# Altium project LitePLC.PrjPcb
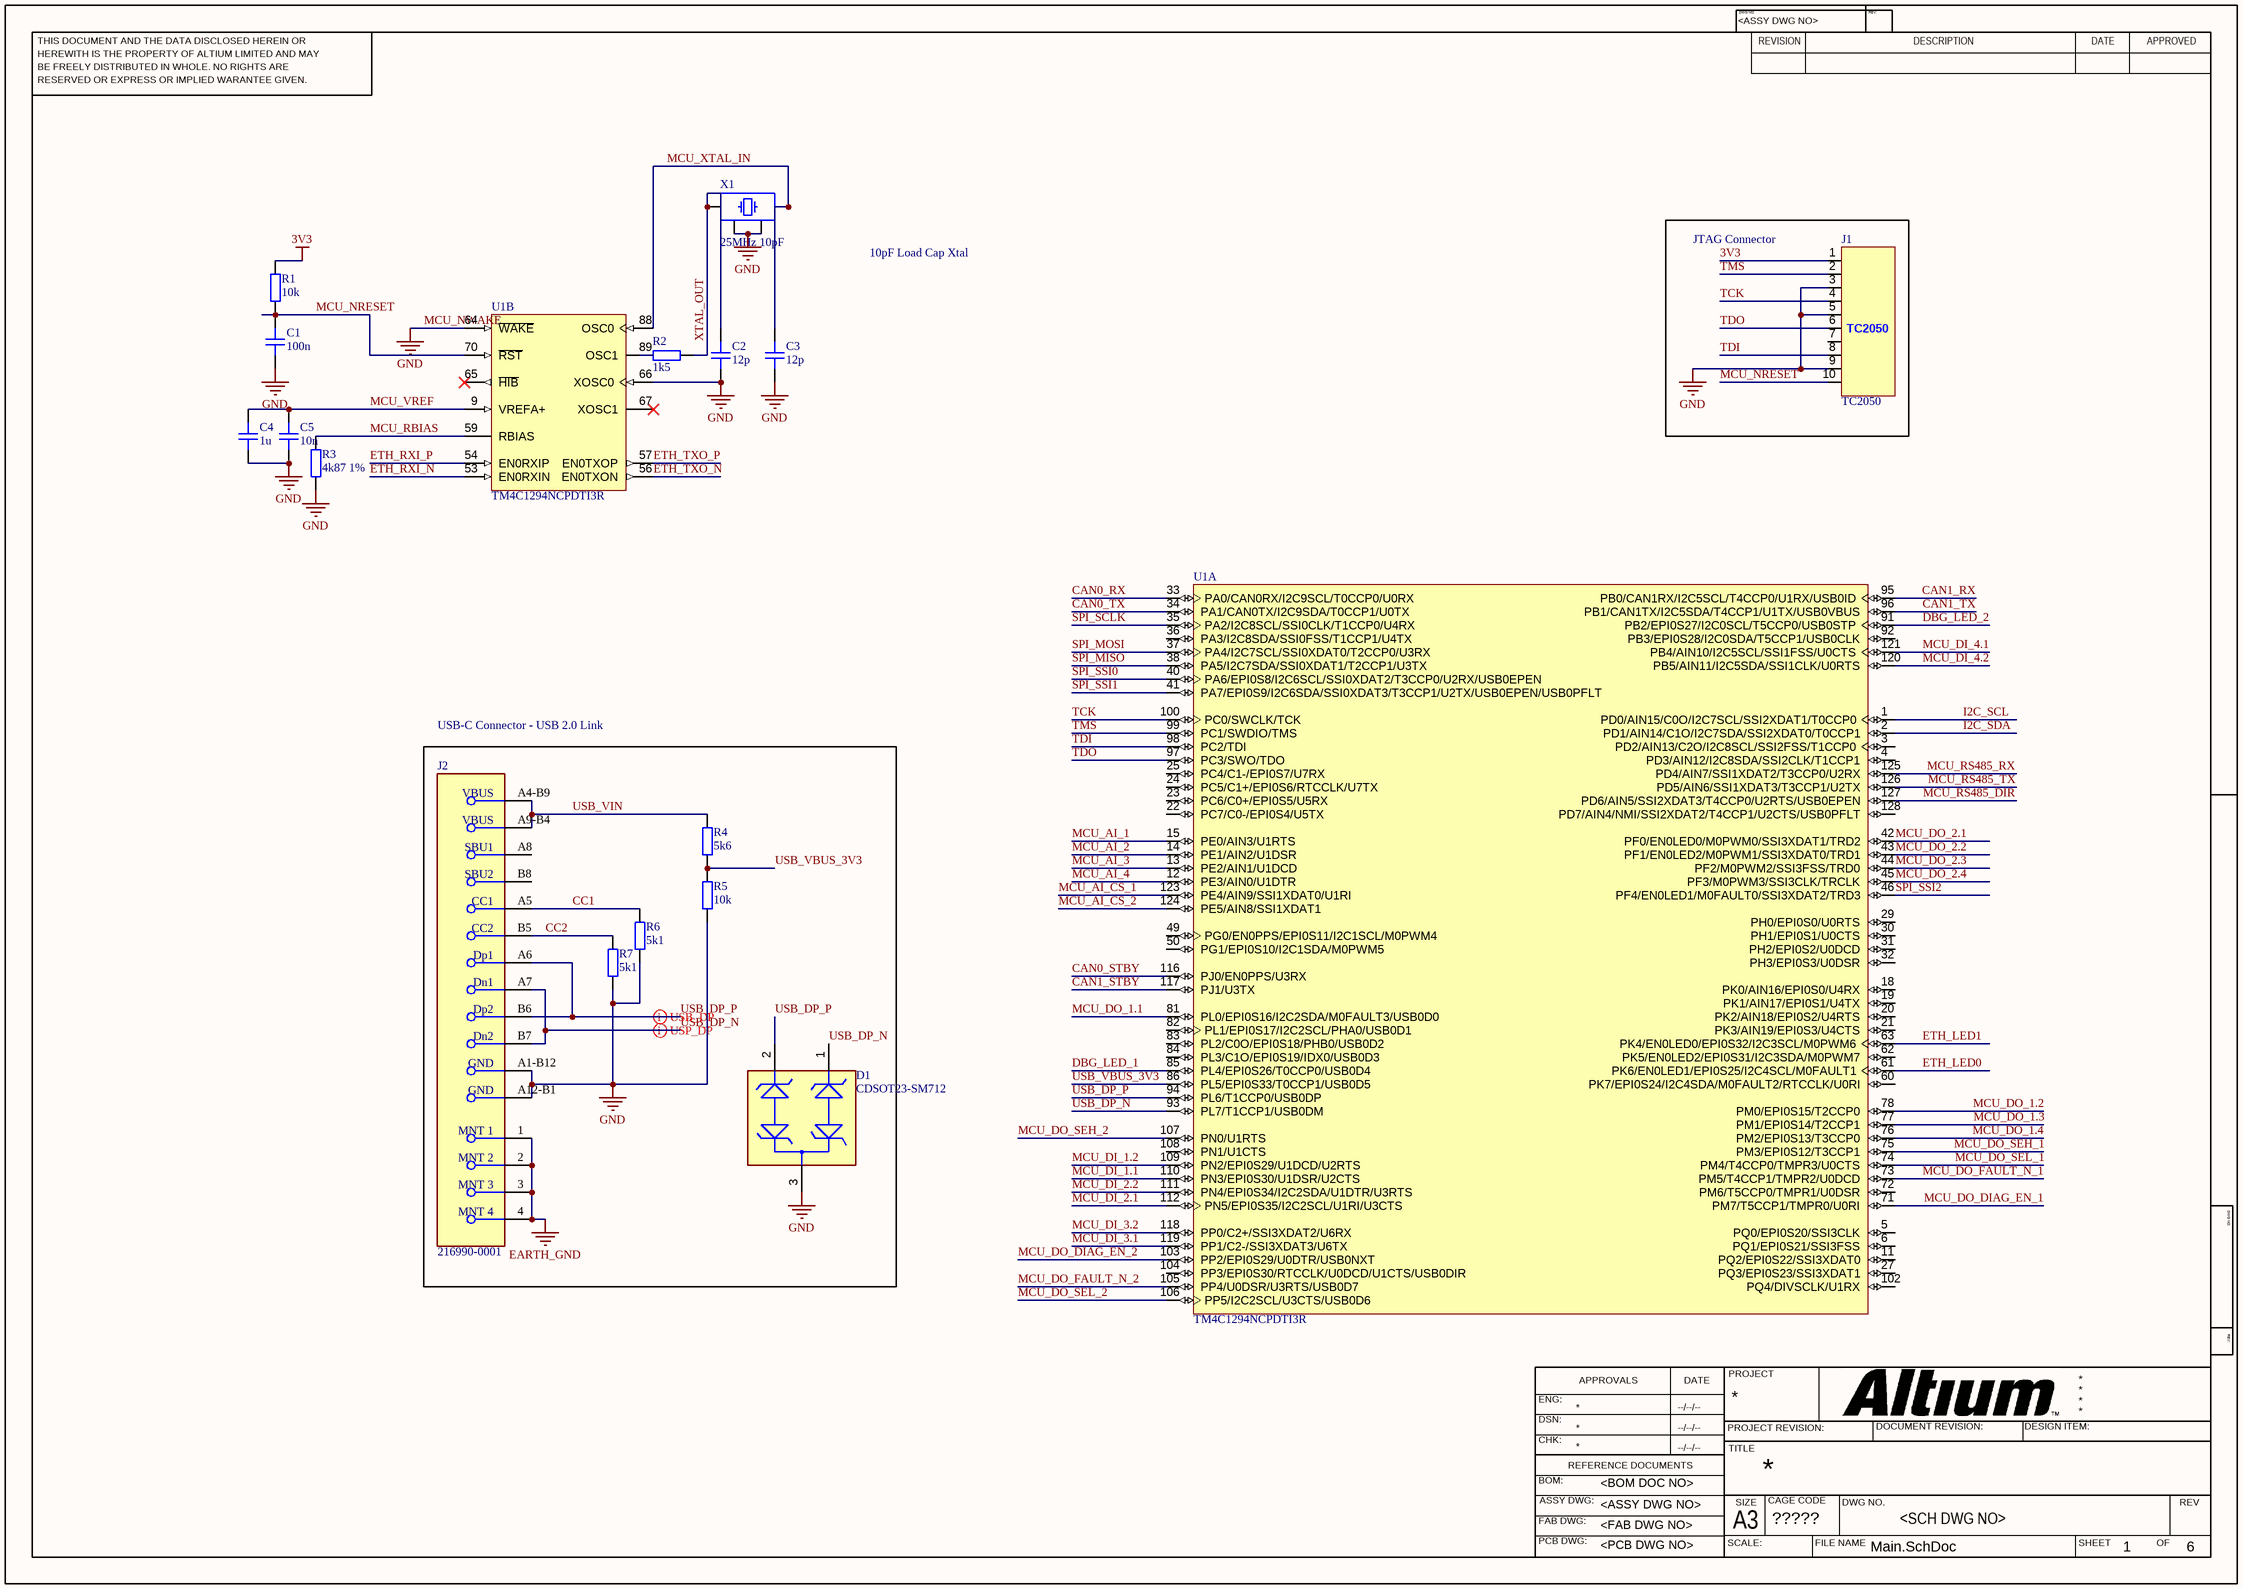
[diagram p0: Main.SchDoc]
CAGE_CODE: ?????; CONTRACT_NUMBER: <CONTRACT NO>; DOC_NO_ASSY_DWG: <ASSY DWG NO>; DOC_NO_BOM: <BOM DOC NO>; DOC_NO_FAB_DWG: <FAB DWG NO>; DOC_NO_SCH_DWG: <SCH DWG NO>; PCB_2_DEC_TOL: +/-.01; PCB_3_DEC_TOL: +/-.010; PCB_ANG_TOL: +/-1/2; PCB_ASSEMBLY_NO: <PCB ASSY NO>; PCB_CHECKER: - -----; PCB_CHECKER_APP_DATE: --/--/----; PCB_DESIGNER: - -----; PCB_DESIGNER_APP_DATE: --/--/----; PCB_DWG_NO: <PCB DWG NO>; PCB_ENGINEER: - -----; PCB_ENGINEER_APP_DATE: --/--/----; PCB_PART_NUMBER: <PCB PN>; PCB_REV: A; SCH_REV: A
5 sheets, 206 parts. Net scope: global (net labels, ports and power ports of the same name join across sheets).
Board file: PCB1.PcbDoc
Sheets:
  Main.SchDoc
  Power.SchDoc
  DigitalIO.SchDoc
  Comm.SchDoc
  Debug.SchDoc

## Sheet Main.SchDoc
size 420 x 297 mm; SheetNumber: 1; SheetTotal: 6; ENG_APP_DATE: --/--/--; DSN_APP_DATE: --/--/--; CHK_APP_DATE: --/--/--

### Parts
C1  100n  [CAP_0402]
C2  12p  [CAP_0402]
C3  12p  [CAP_0402]
C4  1u  [CAP_0402]
C5  10n  [CAP_0402]
D1  CDSOT23-SM712  [FP-SOT23-MFG]
J1  TC2050  [TC2050-FP]  (no BOM)
J2  216990-0001  [FP-216990-0001-MFG]
R1  10k  [RES_0402]
R2  1k5  [RES_0402]
R3  4k87 1%  [RES_0402]
R4  5k6  [RES_0402]
R5  10k  [RES_0402]
R6  5k1  [RES_0402]
R7  5k1  [RES_0402]
U1  TM4C1294NCPDTI3R  [PDT0128A_M]  (parts A,B of 3)
X1  25MHz 10pF  [XTAL_3225]

### Blocks framed on the sheet
JTAG Connector: J1
USB-C Connector - USB 2.0 Link: D1 J2 R4-R7

### Nets
3V3: J1.1 R1.1
EARTH_GND: J2.1(MNT_1) J2.2(MNT_2) J2.3(MNT_3) J2.4(MNT_4)
GND: C1.1 C2.1 C3.1 C4.1 C5.1 D1.3 J1.3 J1.5 J1.9 J2.A1-B12(GND) J2.A12-B1(GND) R3.1 R5.1 R6.1 R7.1 U1.64(~{WAKE}) U1.66(XOSC0) X1.2 X1.4  [also labelled MCU_NWAKE]
CAN0_RX: U1.33(PA0/CAN0RX/I2C9SCL/T0CCP0/U0RX)
CAN0_STBY: U1.116(PJ0/EN0PPS/U3RX)
CAN0_TX: U1.34(PA1/CAN0TX/I2C9SDA/T0CCP1/U0TX)
CAN1_RX: U1.95(PB0/CAN1RX/I2C5SCL/T4CCP0/U1RX/USB0ID)
CAN1_STBY: U1.117(PJ1/U3TX)
CAN1_TX: U1.96(PB1/CAN1TX/I2C5SDA/T4CCP1/U1TX/USB0VBUS)
CC1: J2.A5(CC1) R6.2
CC2: J2.B5(CC2) R7.2
DBG_LED_1: U1.85(PL4/EPI0S26/T0CCP0/USB0D4)
DBG_LED_2: U1.91(PB2/EPI0S27/I2C0SCL/T5CCP0/USB0STP)
ETH_LED0: U1.61(PK6/EN0LED1/EPI0S25/I2C4SCL/M0FAULT1)
ETH_LED1: U1.63(PK4/EN0LED0/EPI0S32/I2C3SCL/M0PWM6)
ETH_RXI_N: U1.53(EN0RXIN)
ETH_RXI_P: U1.54(EN0RXIP)
ETH_TXO_N: U1.56(EN0TXON)
ETH_TXO_P: U1.57(EN0TXOP)
I2C_SCL: U1.1(PD0/AIN15/C0O/I2C7SCL/SSI2XDAT1/T0CCP0)
I2C_SDA: U1.2(PD1/AIN14/C1O/I2C7SDA/SSI2XDAT0/T0CCP1)
MCU_AI_1: U1.15(PE0/AIN3/U1RTS)
MCU_AI_2: U1.14(PE1/AIN2/U1DSR)
MCU_AI_3: U1.13(PE2/AIN1/U1DCD)
MCU_AI_4: U1.12(PE3/AIN0/U1DTR)
MCU_AI_CS_1: U1.123(PE4/AIN9/SSI1XDAT0/U1RI)
MCU_AI_CS_2: U1.124(PE5/AIN8/SSI1XDAT1)
MCU_DI_1.1: U1.110(PN3/EPI0S30/U1DSR/U2CTS)
MCU_DI_1.2: U1.109(PN2/EPI0S29/U1DCD/U2RTS)
MCU_DI_2.1: U1.112(PN5/EPI0S35/I2C2SCL/U1RI/U3CTS)
MCU_DI_2.2: U1.111(PN4/EPI0S34/I2C2SDA/U1DTR/U3RTS)
MCU_DI_3.1: U1.119(PP1/C2-/SSI3XDAT3/U6TX)
MCU_DI_3.2: U1.118(PP0/C2+/SSI3XDAT2/U6RX)
MCU_DI_4.1: U1.121(PB4/AIN10/I2C5SCL/SSI1FSS/U0CTS)
MCU_DI_4.2: U1.120(PB5/AIN11/I2C5SDA/SSI1CLK/U0RTS)
MCU_DO_1.1: U1.81(PL0/EPI0S16/I2C2SDA/M0FAULT3/USB0D0)
MCU_DO_1.2: U1.78(PM0/EPI0S15/T2CCP0)
MCU_DO_1.3: U1.77(PM1/EPI0S14/T2CCP1)
MCU_DO_1.4: U1.76(PM2/EPI0S13/T3CCP0)
MCU_DO_2.1: U1.42(PF0/EN0LED0/M0PWM0/SSI3XDAT1/TRD2)
MCU_DO_2.2: U1.43(PF1/EN0LED2/M0PWM1/SSI3XDAT0/TRD1)
MCU_DO_2.3: U1.44(PF2/M0PWM2/SSI3FSS/TRD0)
MCU_DO_2.4: U1.45(PF3/M0PWM3/SSI3CLK/TRCLK)
MCU_DO_DIAG_EN_1: U1.71(PM7/T5CCP1/TMPR0/U0RI)
MCU_DO_DIAG_EN_2: U1.103(PP2/EPI0S29/U0DTR/USB0NXT)
MCU_DO_FAULT_N_1: U1.73(PM5/T4CCP1/TMPR2/U0DCD)
MCU_DO_FAULT_N_2: U1.105(PP4/U0DSR/U3RTS/USB0D7)
MCU_DO_SEH_1: U1.75(PM3/EPI0S12/T3CCP1)
MCU_DO_SEH_2: U1.107(PN0/U1RTS)
MCU_DO_SEL_1: U1.74(PM4/T4CCP0/TMPR3/U0CTS)
MCU_DO_SEL_2: U1.106(PP5/I2C2SCL/U3CTS/USB0D6)
MCU_NRESET: C1.2 J1.10 R1.2 U1.70(~{RST})
MCU_RBIAS: R3.2 U1.59(RBIAS)
MCU_RS485_DIR: U1.127(PD6/AIN5/SSI2XDAT3/T4CCP0/U2RTS/USB0EPEN)
MCU_RS485_RX: U1.125(PD4/AIN7/SSI1XDAT2/T3CCP0/U2RX)
MCU_RS485_TX: U1.126(PD5/AIN6/SSI1XDAT3/T3CCP1/U2TX)
MCU_VREF: C4.2 C5.2 U1.9(VREFA+)
MCU_XTAL_IN: C3.2 U1.88(OSC0) X1.3
SPI_MISO: U1.38(PA5/I2C7SDA/SSI0XDAT1/T2CCP1/U3TX)
SPI_MOSI: U1.37(PA4/I2C7SCL/SSI0XDAT0/T2CCP0/U3RX)
SPI_SCLK: U1.35(PA2/I2C8SCL/SSI0CLK/T1CCP0/U4RX)
SPI_SSI0: U1.40(PA6/EPI0S8/I2C6SCL/SSI0XDAT2/T3CCP0/U2RX/USB0EPEN)
SPI_SSI1: U1.41(PA7/EPI0S9/I2C6SDA/SSI0XDAT3/T3CCP1/U2TX/USB0EPEN/USB0PFLT)
SPI_SSI2: U1.46(PF4/EN0LED1/M0FAULT0/SSI3XDAT2/TRD3)
TCK: J1.4 U1.100(PC0/SWCLK/TCK)
TDI: J1.8 U1.98(PC2/TDI)
TDO: J1.6 U1.97(PC3/SWO/TDO)
TMS: J1.2 U1.99(PC1/SWDIO/TMS)
USB_DP_N: D1.1 J2.A7(Dn1) J2.B7(Dn2) U1.93(PL7/T1CCP1/USB0DM)
USB_DP_P: D1.2 J2.A6(Dp1) J2.B6(Dp2) U1.94(PL6/T1CCP0/USB0DP)
USB_VBUS_3V3: R4.1 R5.2 U1.86(PL5/EPI0S33/T0CCP1/USB0D5)
USB_VIN: J2.A4-B9(VBUS) J2.A9-B4(VBUS) R4.2
XTAL_OUT: C2.2 R2.2 X1.1
NetR2_1: R2.1 U1.89(OSC1)

Not connected (* = marked no-connect by the designer): J1 7; J2 A8(SBU1) B8(SBU2); U1 3(PD2/AIN13/C2O/I2C8SCL/SSI2FSS/T1CCP0) 4(PD3/AIN12/I2C8SDA/SSI2CLK/T1CCP1) 5(PQ0/EPI0S20/SSI3CLK) 6(PQ1/EPI0S21/SSI3FSS) 11(PQ2/EPI0S22/SSI3XDAT0) 18(PK0/AIN16/EPI0S0/U4RX) 19(PK1/AIN17/EPI0S1/U4TX) 20(PK2/AIN18/EPI0S2/U4RTS) 21(PK3/AIN19/EPI0S3/U4CTS) 22(PC7/C0-/EPI0S4/U5TX) 23(PC6/C0+/EPI0S5/U5RX) 24(PC5/C1+/EPI0S6/RTCCLK/U7TX) 25(PC4/C1-/EPI0S7/U7RX) 27(PQ3/EPI0S23/SSI3XDAT1) 29(PH0/EPI0S0/U0RTS) 30(PH1/EPI0S1/U0CTS) 31(PH2/EPI0S2/U0DCD) 32(PH3/EPI0S3/U0DSR) 36(PA3/I2C8SDA/SSI0FSS/T1CCP1/U4TX) 49(PG0/EN0PPS/EPI0S11/I2C1SCL/M0PWM4) 50(PG1/EPI0S10/I2C1SDA/M0PWM5) 60(PK7/EPI0S24/I2C4SDA/M0FAULT2/RTCCLK/U0RI) 62(PK5/EN0LED2/EPI0S31/I2C3SDA/M0PWM7) 65(~{HIB})* 67(XOSC1)* 72(PM6/T5CCP0/TMPR1/U0DSR) 82(PL1/EPI0S17/I2C2SCL/PHA0/USB0D1) 83(PL2/C0O/EPI0S18/PHB0/USB0D2) 84(PL3/C1O/EPI0S19/IDX0/USB0D3) 92(PB3/EPI0S28/I2C0SDA/T5CCP1/USB0CLK) 102(PQ4/DIVSCLK/U1RX) 104(PP3/EPI0S30/RTCCLK/U0DCD/U1CTS/USB0DIR) 108(PN1/U1CTS) 128(PD7/AIN4/NMI/SSI2XDAT2/T4CCP1/U2CTS/USB0PFLT)

### Layout directives
differential pair; differential pair class USB: USB_DP_N, USB_DP_P

### Notes on the sheet
- 10pF Load Cap Xtal
- THIS DOCUMENT AND THE DATA DISCLOSED HEREIN OR
- HEREWITH IS THE PROPERTY OF ALTIUM LIMITED AND MAY
- DWG NO:
- REVISION
- REV:
- DESCRIPTION
- DATE
- APPROVED
- BE FREELY DISTRIBUTED IN WHOLE. NO RIGHTS ARE
- RESERVED OR EXPRESS OR IMPLIED WARANTEE GIVEN.
- ENG:
- APPROVALS
- PROJECT
- DSN:
- CHK:
- REFERENCE DOCUMENTS
- PROJECT REVISION:
- TITLE
- DOCUMENT REVISION:
- DESIGN ITEM:
- BOM:
- FAB DWG:
- PCB DWG:
- ASSY DWG:
- SCALE:
- A3
- SIZE
- CAGE CODE
- FILE NAME
- DWG NO.
- SHEET
- OF
- REV

### Library data of the parts
C1-C5 = CAP_0402: Capacitor SMD 0402; Manufacturer: *; Manufacturer Part Number: *; Distributor Link: *; LCSC: *; Rating: *; Dielectric: *
D1 = CMP-2000-05081-2: TVS DIODE 5V; Manufacturer: Bourns Inc.; Peak Pulse Current: 17A; Standoff Height: 0.05mm; Breakdown Voltage: 7.5V; Direction: Bidirectional; Clamping Voltage: 26V; Value: 75pF; Number Of Channels: 2; Reverse Standoff Voltage: 12V; Peak Pulse Power: 400W; Temperature Range Low: -55°C; Mouser Description: Transient Voltage Suppressor, TVS, CDSOT23 Series, Unidirectional, 12 V, SOT-23, 3, 13.3 V; Device Class L3: unset; Package: SOT23; Height: 1.17mm; RoHS: TRUE; Octopart: https://octopart.com/cdsot23-sm712-bourns-7576327; Category: Diode; Ipc Land Pattern Name: SOT95P229X103-3; ComponentLink2URL: https://www.bourns.com/docs/Product-Datasheets/CDSOT23-SM712.pdf; Temperature Range High: +150°C; ComponentLink2Description: Datasheet; Digikey Description: TVS DIODE 7V/12V 14V/26V SOT23-3; Manufacturer Part Number: CDSOT23-SM712; Temperature: -55°C to +150°C; Device Class L2: TVS Diodes; Lead Free: Yes; Device Class L1: Circuit Protection; Automotive: No; Capacitance: 75pF
J1 = TC2050: Tag-Connect No-Solder SWD Debug Connector DO NOT PLACE; Manufacturer: Tag-Connect; Manufacturer Part Number: TC2050
J2 = CMP-04767-000014-1: CONN RCP USB2.0 TYP C 24P SMD RA
R1-R7 = RES_0402: Resistor SMD 0402; Manufacturer: *; Manufacturer Part Number: *; Distributor Link: *; LCSC: *
U1 = CMP-0945-00007-2: Tiva C Series Microcontroller, 1024 KB Flash, 256 KB SRAM, 12 Bit, 20 Channels, -40 to 85 degC, 128-Pin TQFP (PDT), Green (RoHS & no Sb/Br), Tape and Reel; Manufacturer: Texas Instruments; SRAM: 256 KB; ADC Resolution: 12 Bits; Max Speed: 120 MHz; CPU: ARM Cortex-M4; ADC Channels: 20; Flash: 1024 KB; ComponentLink1Description: Manufacturer URL; PartNumber: TM4C1294NCPDTI3R; ComponentLink2URL: http://www.ti.com/lit/ds/symlink/tm4c1294ncpdt.pdf; ComponentLink1URL: http://www.ti.com/; Packing: Tape and Reel; PackageReference: PDT0128A; PackageVersion: 4087726/A; Temperature Range: -40 to 85 degC; ComponentLink2Description: Datasheet; DatasheetVersion: 15863.2743; ComponentLink3URL: http://www.ti.com/lit/ml/mpqf013/mpqf013.pdf; ComponentLink3Description: Package Specification; Mounting Technology: Surface Mount; Eco-Plan: Green (RoHS & no Sb/Br); PackageDescription: 128-Pin Thin Quad Flat Package, Body 14 x 14 mm, Pitch 0.4 mm
X1 = TSX-3225_24.0000MF15X-AC: Crystal SMD 24MHz 10PPM 7pF 3225; Manufacturer: Epson; Manufacturer Part Number: TSX-3225 24.0000MF15X-AC

## Sheet Power.SchDoc
size 420 x 297 mm; SheetNumber: 2; SheetTotal: 6
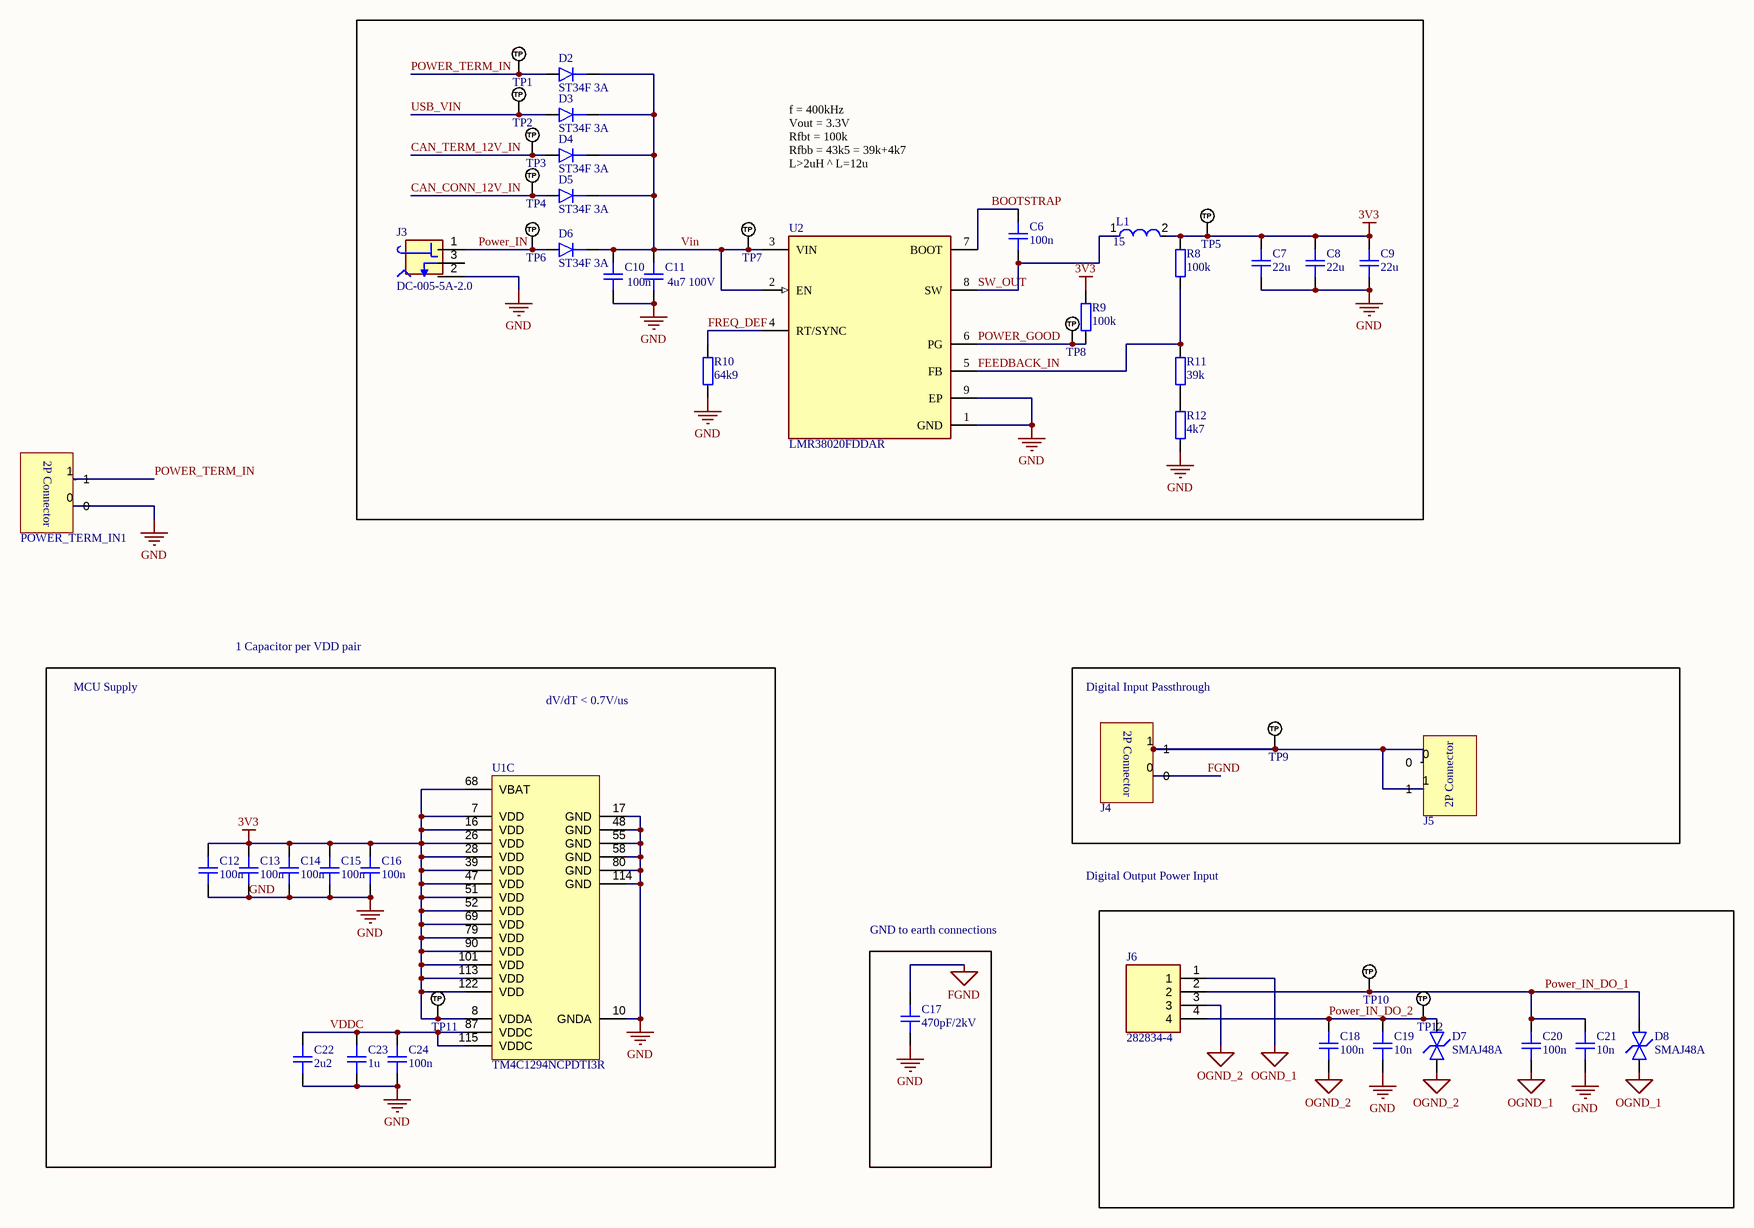
[diagram p1: Power.SchDoc]

### Parts
C6  100n  [CAP_0402]
C7  22u  [CAP_1206]
C8  22u  [CAP_1206]
C9  22u  [CAP_1206]
C10  100n  [CAP_1206]
C11  4u7 100V  [CAP_1206]
C12  100n  [CAP_0402]
C13  100n  [CAP_0402]
C14  100n  [CAP_0402]
C15  100n  [CAP_0402]
C16  100n  [CAP_0402]
C17  470pF/2kV  [CAP_1206]
C18  100n  [CAP_0603]
C19  10n  [CAP_0603]
C20  100n  [CAP_0603]
C21  10n  [CAP_0603]
C22  2u2  [CAP_0402]
C23  1u  [CAP_0402]
C24  100n  [CAP_0402]
D2  ST34F 3A  [DO-214AC-2 (SMA)]
D3  ST34F 3A  [DO-214AC-2 (SMA)]
D4  ST34F 3A  [DO-214AC-2 (SMA)]
D5  ST34F 3A  [DO-214AC-2 (SMA)]
D6  ST34F 3A  [DO-214AC-2 (SMA)]
D7  SMAJ48A  [DO-214AC-2 (SMA)]
D8  SMAJ48A  [DO-214AC-2 (SMA)]
J3  DC-005-5A-2.0  [XKB_DC-005-5A-2.0]
J4  DG308-2.54-02P-12-00AH  [DG308-2.54-02P-12-00AH-Footprint-1]  (value not drawn)
J5  DG308-2.54-02P-12-00AH  [DG308-2.54-02P-12-00AH-Footprint-1]  (value not drawn)
J6  282834-4  [TE_282834-4]
L1  15  [FP-SPM10040-MFG]
POWER_TERM_IN1  DG308-2.54-02P-12-00AH  [DG308-2.54-02P-12-00AH-Footprint-1]  (value not drawn)
R8  100k  [RES_0402]
R9  100k  [RES_0402]
R10  64k9  [RES_0402]
R11  39k  [RES_0402]
R12  4k7  [RES_0402]
TP1  TP_NOBOM  [PAD_RND_1MM]  (value not drawn)  (no BOM)
TP2  TP_NOBOM  [PAD_RND_1MM]  (value not drawn)  (no BOM)
TP3  TP_NOBOM  [PAD_RND_1MM]  (value not drawn)  (no BOM)
TP4  TP_NOBOM  [PAD_RND_1MM]  (value not drawn)  (no BOM)
TP5  TP_NOBOM  [PAD_RND_1MM]  (value not drawn)  (no BOM)
TP6  TP_NOBOM  [PAD_RND_1MM]  (value not drawn)  (no BOM)
TP7  TP_NOBOM  [PAD_RND_1MM]  (value not drawn)  (no BOM)
TP8  TP_NOBOM  [PAD_RND_1MM]  (value not drawn)  (no BOM)
TP9  TP_NOBOM  [PAD_RND_1MM]  (value not drawn)  (no BOM)
TP10  TP_NOBOM  [PAD_RND_1MM]  (value not drawn)  (no BOM)
TP11  TP_NOBOM  [PAD_RND_1MM]  (value not drawn)  (no BOM)
TP12  TP_NOBOM  [PAD_RND_1MM]  (value not drawn)  (no BOM)
U1  TM4C1294NCPDTI3R  [PDT0128A_M]  (part C of 3)
U2  LMR38020FDDAR  [FP-DDA0008E-IPC_C]

### Blocks framed on the sheet
Digital Input Passthrough: J4 J5 TP9
GND to earth connections: C17

### Nets
3V3: C7.2 C8.2 C9.2 C12.2 C13.2 C14.2 C15.2 C16.2 L1.2 R8.2 R9.2 TP5.1(TP) TP11.1(TP) U1.7(VDD) U1.8(VDDA) U1.16(VDD) U1.26(VDD) U1.28(VDD) U1.39(VDD) U1.47(VDD) U1.51(VDD) U1.52(VDD) U1.68(VBAT) U1.69(VDD) U1.79(VDD) U1.90(VDD) U1.101(VDD) U1.113(VDD) U1.122(VDD)
FGND: C17.2 J4.0
GND: C7.1 C8.1 C9.1 C10.1 C11.1 C12.1 C13.1 C14.1 C15.1 C16.1 C17.1 C19.1 C21.1 C22.1 C23.1 C24.1 J3.2 POWER_TERM_IN1.0 R10.1 R12.1 U1.10(GNDA) U1.17(GND) U1.48(GND) U1.55(GND) U1.58(GND) U1.80(GND) U1.114(GND) U2.1(GND) U2.9(EP)
OGND_1: C20.1 D8.A J6.1
OGND_2: C18.1 D7.A J6.3
BOOTSTRAP: C6.2 U2.7(BOOT)
CAN_CONN_12V_IN: D5.A TP4.1(TP)
CAN_TERM_12V_IN: D4.A TP3.1(TP)
FEEDBACK_IN: R8.1 R11.2 U2.5(FB)
FREQ_DEF: R10.2 U2.4(RT/SYNC)
POWER_GOOD: R9.1 TP8.1(TP) U2.6(PG)
Power_IN: D6.A J3.1 TP6.1(TP)
Power_IN_DO_1: C20.2 C21.2 D8.K J6.2 TP10.1(TP)
Power_IN_DO_2: C18.2 C19.2 D7.K J6.4 TP12.1(TP)
POWER_TERM_IN: D2.A POWER_TERM_IN1.1 TP1.1(TP)
SW_OUT: C6.1 L1.1 U2.8(SW)
USB_VIN: D3.A TP2.1(TP)
VDDC: C22.2 C23.2 C24.2 U1.87(VDDC) U1.115(VDDC)
Vin: C10.2 C11.2 D2.K D3.K D4.K D5.K D6.K TP7.1(TP) U2.2(EN) U2.3(VIN)
NetJ4_1: J4.1 J5.0 J5.1 TP9.1(TP)
NetR11_1: R11.1 R12.2

Not connected (* = marked no-connect by the designer): J3 3

### Notes on the sheet
- f = 400kHz
  Vout = 3.3V
  Rfbt = 100k
  Rfbb = 43k5 = 39k+4k7
  L>2uH ^ L=12u
- 1 Capacitor per VDD pair
- MCU Supply
- dV/dT < 0.7V/us
- Digital Output Power Input
- THIS DOCUMENT AND THE DATA DISCLOSED HEREIN OR
- HEREWITH IS THE PROPERTY OF ALTIUM LIMITED AND MAY
- DWG NO:
- REVISION
- REV:
- DESCRIPTION
- DATE
- APPROVED
- BE FREELY DISTRIBUTED IN WHOLE. NO RIGHTS ARE
- RESERVED OR EXPRESS OR IMPLIED WARANTEE GIVEN.
- ENG:
- APPROVALS
- PROJECT
- DSN:
- CHK:
- REFERENCE DOCUMENTS
- PROJECT REVISION:
- TITLE
- DOCUMENT REVISION:
- DESIGN ITEM:
- BOM:
- FAB DWG:
- PCB DWG:
- ASSY DWG:
- SCALE:
- A3
- SIZE
- CAGE CODE
- FILE NAME
- DWG NO.
- SHEET
- OF
- REV
- (in symbol CMP-002-00074-3) 2P Connector

### Library data of the parts
C6 C12-C16 C22-C24 = CAP_0402: Capacitor SMD 0402; Manufacturer: *; Manufacturer Part Number: *; Distributor Link: *; LCSC: *; Rating: *; Dielectric: *
C7-C11 C17 = CAP_1206: Capacitor SMD 1206; Manufacturer: *; Manufacturer Part Number: *; Distributor Link: *; LCSC: *; Rating: *; Dielectric: *
C18-C21 = CAP_0603: Capacitor SMD 0603; Manufacturer: *; Manufacturer Part Number: *; Distributor Link: *; LCSC: *; Rating: *; Dielectric: *
D2-D6 = D_SMA: Diode SMD SMA (DO-214AA)
D7 D8 = D_TVS_BI_SMC: Diode TVS / ESD Bidirectional SMC (DO-214AB); Manufacturer Part Number: *; Manufacturer: *; Distributor Link: *
J3 = CMP-002-00075-8: DC Power Receptacle Jack, Through Holeï¼ŒRight Angle; MF: XKB Industrial Precision; Value: *; Pins: 3; MP: DC-005-5A-2.0; Check_prices: https://www.snapeda.com/parts/DC-005-5A-2.0/XKB+Industrial+Precision/view-part/?ref=eda; Design Item ID: DC-005-5A-2.0; Source: DC-005-5A-2.0.SchLib; Component Type: Standard; Price: None; Case/Package: Package; SnapEDA_Link: https://www.snapeda.com/parts/DC-005-5A-2.0/XKB+Industrial+Precision/view-part/?ref=snap; Availability: Not in stock
J4 J5 POWER_TERM_IN1 = CMP-002-00074-3: 1x2P -40℃~+105℃ 8A 130V Green 18~26 Straight 2.54mm 0.5~1 1 2 Plugin,P=2.54mm Screw terminal ROHS
J6 = 282834-4: 4 Position Wire to Board Terminal Block Horizontal with Board 0.100 (2.54mm) Through Hole; MF: TE Connectivity; Package: None; MP: 282834-4; Price: None; Value: *; Availability: In Stock; Check_prices: https://www.snapeda.com/parts/282834-4/TE+Connectivity+AMP+Connectors/view-part/?ref=eda; Purchase-URL: https://pricing.snapeda.com/search/part/282834-4/?ref=eda; EU_RoHS_Compliance: Compliant with Exemptions; SnapEDA_Link: https://www.snapeda.com/parts/282834-4/TE+Connectivity+AMP+Connectors/view-part/?ref=snap
L1 = CMP-08253-000004-1: FIXED IND 2.2UH 16.7A 7.46MOHM; Manufacturer: TDK; Manufacturer Part Number: SPM10040T-2R2M-HZ; Test Frequency: 100kHz; Tolerance: 20%; Automotive Grade: Grade 1; Saturation Current: 13A; Shielding: true; Series Resistance: 7.48mΩ; Core Material: Metal; Lead Free: Yes; Rms Current: 16.7A; Category: Ind; Temperature Range High: +125°C; Device Class L1: Passive Components; Inductance: 2.2uH; RoHS: TRUE; Device Class L2: Inductors; ComponentLink2URL: https://product.tdk.com/info/en/catalog/datasheets/inductor_automotive_power_spm10040-hz_en.pdf; Device Class L3: Fixed Inductors; Temperature: -40°C to +125°C; Octopart: https://octopart.com/spm10040t-2r2m-hz-tdk-91421299; Package: SPM10040; Height: 4mm; Composition: Wirewound; Temperature Range Low: -40°C; Automotive: Yes; ComponentLink2Description: Datasheet; Mouser Description: Inductor Power Shielded Wirewound 2.2uH 20% 100KHz Metal 16.7A 0.00746Ohm DCR Automotive T/R; Digikey Description: FIXED IND 2.2UH 16.7A 7.46MOHM; Value: 2.2uH
R8-R12 = RES_0402: Resistor SMD 0402; Manufacturer: *; Manufacturer Part Number: *; Distributor Link: *; LCSC: *
TP1-TP12 = TEST_POINT_RND_1MM: Test Point Round 1mm (NO BOM)
U1 = CMP-0945-00007-2: as U1 on sheet Main; ComponentLink1Description: Manufacturer URL; PartNumber: TM4C1294NCPDTI3R; ComponentLink2URL: http://www.ti.com/lit/ds/symlink/tm4c1294ncpdt.pdf; ComponentLink1URL: http://www.ti.com/; Packing: Tape and Reel; PackageReference: PDT0128A; PackageVersion: 4087726/A; Temperature Range: -40 to 85 degC; ComponentLink2Description: Datasheet; DatasheetVersion: 15863.2743; ComponentLink3URL: http://www.ti.com/lit/ml/mpqf013/mpqf013.pdf; ComponentLink3Description: Package Specification; Mounting Technology: Surface Mount; Eco-Plan: Green (RoHS & no Sb/Br); PackageDescription: 128-Pin Thin Quad Flat Package, Body 14 x 14 mm, Pitch 0.4 mm
U2 = CMP-04918-000734-1: 4.2-V to 80-V, 2-A Synchronous Buck Converter with 40-µA IQ

## Sheet DigitalIO.SchDoc
size A2; SheetNumber: 3; SheetTotal: 6
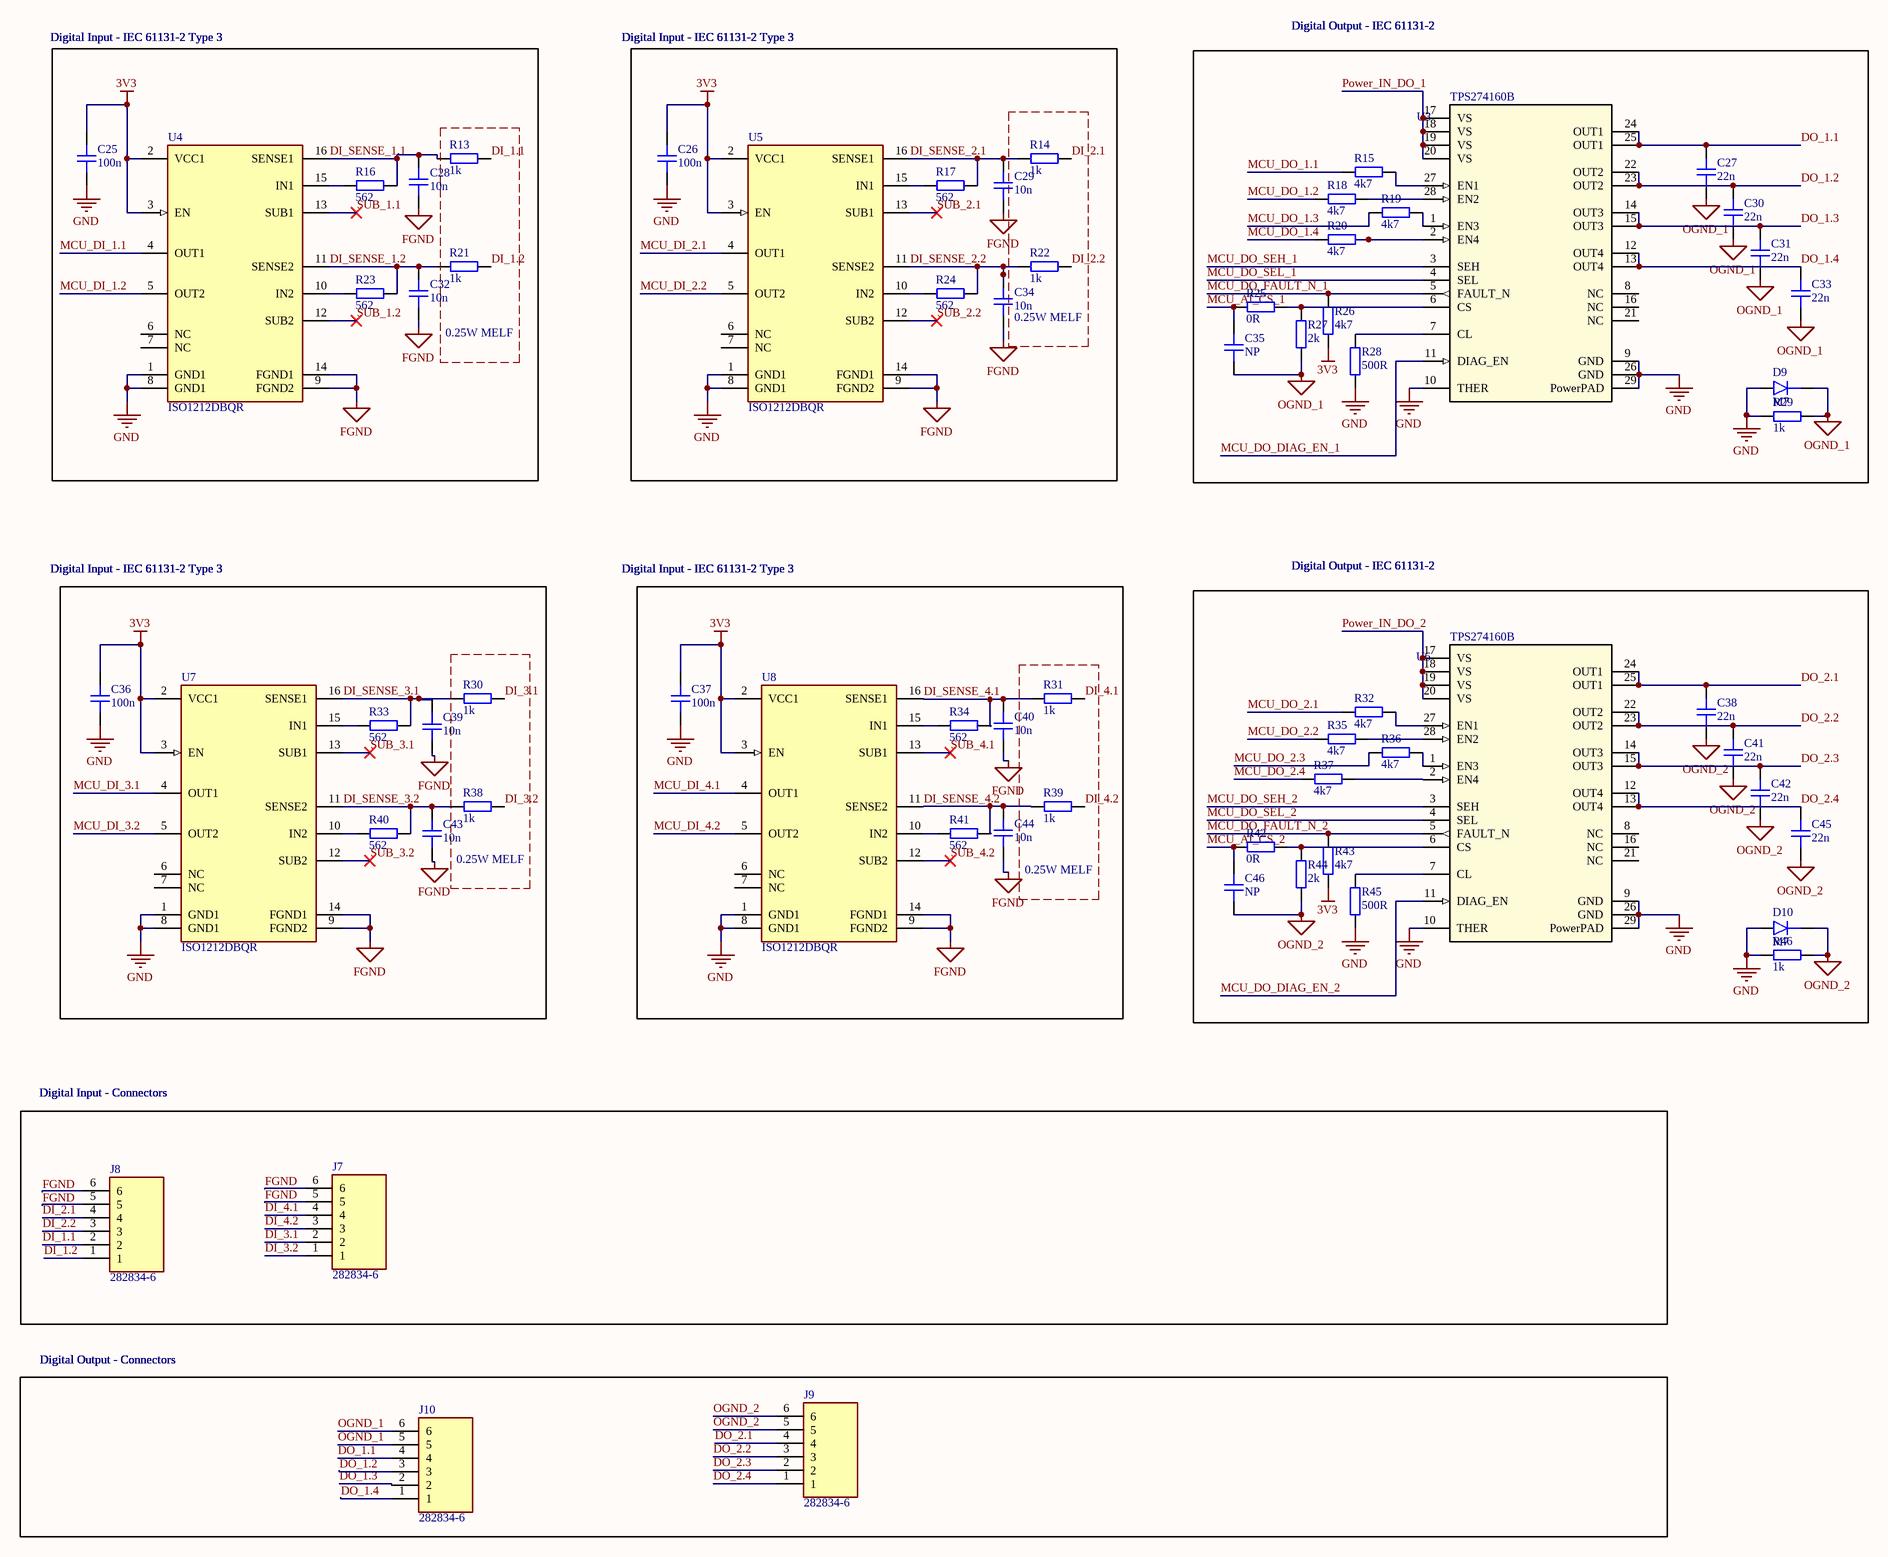
[diagram p2: DigitalIO.SchDoc]

### Parts
C25  100n  [CAP_0402]
C26  100n  [CAP_0402]
C27  22n  [CAP_0603]
C28  10n  [CAP_0603]
C29  10n  [CAP_0603]
C30  22n  [CAP_0603]
C31  22n  [CAP_0603]
C32  10n  [CAP_0603]
C33  22n  [CAP_0603]
C34  10n  [CAP_0603]
C35  NP  [CAP_0402]  (no BOM)
C36  100n  [CAP_0402]
C37  100n  [CAP_0402]
C38  22n  [CAP_0603]
C39  10n  [CAP_0603]
C40  10n  [CAP_0603]
C41  22n  [CAP_0603]
C42  22n  [CAP_0603]
C43  10n  [CAP_0603]
C44  10n  [CAP_0603]
C45  22n  [CAP_0603]
C46  NP  [CAP_0402]  (no BOM)
D9  M7  [DO-214AC-2 (SMA)]
D10  M7  [DO-214AC-2 (SMA)]
J7  282834-6  [TE_282834-6]
J8  282834-6  [TE_282834-6]
J9  282834-6  [TE_282834-6]
J10  282834-6  [TE_282834-6]
R13  1k  [FP-MMA0204-MFG]
R14  1k  [FP-MMA0204-MFG]
R15  4k7  [RES_0402]
R16  562  [RES_0402]
R17  562  [RES_0402]
R18  4k7  [RES_0402]
R19  4k7  [RES_0402]
R20  4k7  [RES_0402]
R21  1k  [FP-MMA0204-MFG]
R22  1k  [FP-MMA0204-MFG]
R23  562  [RES_0402]
R24  562  [RES_0402]
R25  0R  [RES_0402]
R26  4k7  [RES_0402]
R27  2k  [RES_0402]
R28  500R  [RES_0402]
R29  1k  [RES_1206]
R30  1k  [FP-MMA0204-MFG]
R31  1k  [FP-MMA0204-MFG]
R32  4k7  [RES_0402]
R33  562  [RES_0402]
R34  562  [RES_0402]
R35  4k7  [RES_0402]
R36  4k7  [RES_0402]
R37  4k7  [RES_0402]
R38  1k  [FP-MMA0204-MFG]
R39  1k  [FP-MMA0204-MFG]
R40  562  [RES_0402]
R41  562  [RES_0402]
R42  0R  [RES_0402]
R43  4k7  [RES_0402]
R44  2k  [RES_0402]
R45  500R  [RES_0402]
R46  1k  [RES_1206]
U3  TPS274160B  [RLH0028A-MFG]
U4  ISO1212DBQR  [FP-DBQ0016A-MFG]
U5  ISO1212DBQR  [FP-DBQ0016A-MFG]
U6  TPS274160B  [RLH0028A-MFG]
U7  ISO1212DBQR  [FP-DBQ0016A-MFG]
U8  ISO1212DBQR  [FP-DBQ0016A-MFG]

### Blocks framed on the sheet
0.25W MELF: R13 R21
0.25W MELF: R14 R22
0.25W MELF: R30 R38
0.25W MELF: R31 R39

### Nets
3V3: C25.2 C26.2 C36.2 C37.2 R26.2 R43.2 U4.2(VCC1) U4.3(EN) U5.2(VCC1) U5.3(EN) U7.2(VCC1) U7.3(EN) U8.2(VCC1) U8.3(EN)
FGND: C28.1 C29.1 C32.1 C34.1 C39.1 C40.1 C43.1 C44.1 J7.5 J7.6 J8.5 J8.6 U4.9(FGND2) U4.14(FGND1) U5.9(FGND2) U5.14(FGND1) U7.9(FGND2) U7.14(FGND1) U8.9(FGND2) U8.14(FGND1)
GND: C25.1 C26.1 C36.1 C37.1 D9.A D10.A R28.2 R29.1 R45.2 R46.1 U3.9(GND) U3.10(THER) U3.26(GND) U3.29(PowerPAD) U4.1(GND1) U4.8(GND1) U5.1(GND1) U5.8(GND1) U6.9(GND) U6.10(THER) U6.26(GND) U6.29(PowerPAD) U7.1(GND1) U7.8(GND1) U8.1(GND1) U8.8(GND1)
OGND_1: C27.1 C30.1 C31.1 C33.1 C35.1 D9.K J10.5 J10.6 R27.2 R29.2
OGND_2: C38.1 C41.1 C42.1 C45.1 C46.1 D10.K J9.5 J9.6 R44.2 R46.2
DI_1.1: J8.2 R13.1
DI_1.2: J8.1 R21.1
DI_2.1: J8.4 R14.1
DI_2.2: J8.3 R22.1
DI_3.1: J7.2 R30.1
DI_3.2: J7.1 R38.1
DI_4.1: J7.4 R31.1
DI_4.2: J7.3 R39.1
DI_SENSE_1.1: C28.2 R13.2 R16.1 U4.16(SENSE1)
DI_SENSE_1.2: C32.2 R21.2 R23.1 U4.11(SENSE2)
DI_SENSE_2.1: C29.2 R14.2 R17.1 U5.16(SENSE1)
DI_SENSE_2.2: C34.2 R22.2 R24.1 U5.11(SENSE2)
DI_SENSE_3.1: C39.2 R30.2 R33.1 U7.16(SENSE1)
DI_SENSE_3.2: C43.2 R38.2 R40.1 U7.11(SENSE2)
DI_SENSE_4.1: C40.2 R31.2 R34.1 U8.16(SENSE1)
DI_SENSE_4.2: C44.2 R39.2 R41.1 U8.11(SENSE2)
DO_1.1: C27.2 J10.4 U3.24(OUT1) U3.25(OUT1)
DO_1.2: C30.2 J10.3 U3.22(OUT2) U3.23(OUT2)
DO_1.3: C31.2 J10.2 U3.14(OUT3) U3.15(OUT3)
DO_1.4: C33.2 J10.1 U3.12(OUT4) U3.13(OUT4)
DO_2.1: C38.2 J9.4 U6.24(OUT1) U6.25(OUT1)
DO_2.2: C41.2 J9.3 U6.22(OUT2) U6.23(OUT2)
DO_2.3: C42.2 J9.2 U6.14(OUT3) U6.15(OUT3)
DO_2.4: C45.2 J9.1 U6.12(OUT4) U6.13(OUT4)
MCU_AI_CS_1: C35.2 R25.1
MCU_AI_CS_2: C46.2 R42.1
MCU_DI_1.1: U4.4(OUT1)
MCU_DI_1.2: U4.5(OUT2)
MCU_DI_2.1: U5.4(OUT1)
MCU_DI_2.2: U5.5(OUT2)
MCU_DI_3.1: U7.4(OUT1)
MCU_DI_3.2: U7.5(OUT2)
MCU_DI_4.1: U8.4(OUT1)
MCU_DI_4.2: U8.5(OUT2)
MCU_DO_1.1: R15.2
MCU_DO_1.2: R18.2
MCU_DO_1.3: R19.2
MCU_DO_1.4: R20.2
MCU_DO_2.1: R32.2
MCU_DO_2.2: R35.2
MCU_DO_2.3: R36.2
MCU_DO_2.4: R37.2
MCU_DO_DIAG_EN_1: U3.11(DIAG_EN)
MCU_DO_DIAG_EN_2: U6.11(DIAG_EN)
MCU_DO_FAULT_N_1: R26.1 U3.5(FAULT_N)
MCU_DO_FAULT_N_2: R43.1 U6.5(FAULT_N)
MCU_DO_SEH_1: U3.3(SEH)
MCU_DO_SEH_2: U6.3(SEH)
MCU_DO_SEL_1: U3.4(SEL)
MCU_DO_SEL_2: U6.4(SEL)
Power_IN_DO_1: U3.17(VS) U3.18(VS) U3.19(VS) U3.20(VS)
Power_IN_DO_2: U6.17(VS) U6.18(VS) U6.19(VS) U6.20(VS)
SUB_1.1: U4.13(SUB1)
SUB_1.2: U4.12(SUB2)
SUB_2.1: U5.13(SUB1)
SUB_2.2: U5.12(SUB2)
SUB_3.1: U7.13(SUB1)
SUB_3.2: U7.12(SUB2)
SUB_4.1: U8.13(SUB1)
SUB_4.2: U8.12(SUB2)
NetR15_1: R15.1 U3.27(EN1)
NetR16_2: R16.2 U4.15(IN1)
NetR17_2: R17.2 U5.15(IN1)
NetR18_1: R18.1 U3.28(EN2)
NetR19_1: R19.1 U3.1(EN3)
NetR20_1: R20.1 U3.2(EN4)
NetR23_2: R23.2 U4.10(IN2)
NetR24_2: R24.2 U5.10(IN2)
NetR25_2: R25.2 R27.1 U3.6(CS)
NetR28_1: R28.1 U3.7(CL)
NetR32_1: R32.1 U6.27(EN1)
NetR33_2: R33.2 U7.15(IN1)
NetR34_2: R34.2 U8.15(IN1)
NetR35_1: R35.1 U6.28(EN2)
NetR36_1: R36.1 U6.1(EN3)
NetR37_1: R37.1 U6.2(EN4)
NetR40_2: R40.2 U7.10(IN2)
NetR41_2: R41.2 U8.10(IN2)
NetR42_2: R42.2 R44.1 U6.6(CS)
NetR45_1: R45.1 U6.7(CL)

Not connected (* = marked no-connect by the designer): U3 8(NC) 16(NC) 21(NC); U4 6(NC) 7(NC); U5 6(NC) 7(NC); U6 8(NC) 16(NC) 21(NC); U7 6(NC) 7(NC); U8 6(NC) 7(NC)

### Notes on the sheet
- Digital Input - IEC 61131-2 Type 3
- Digital Output - IEC 61131-2
- Digital Input - Connectors
- Digital Output - Connectors

### Library data of the parts
C25 C26 C35-C37 C46 = CAP_0402: Capacitor SMD 0402; Manufacturer: *; Manufacturer Part Number: *; Distributor Link: *; LCSC: *; Rating: *; Dielectric: *
C27-C34 C38-C45 = CAP_0603: Capacitor SMD 0603; Manufacturer: *; Manufacturer Part Number: *; Distributor Link: *; LCSC: *; Rating: *; Dielectric: *
D9 D10 = D_SMA: Diode SMD SMA (DO-214AA)
J7-J10 = CMP-035-000000-2: Connector - 6 Points; MF: {'manufacturer': 'TE Connectivity'}; Availability: Unavailable; Design Item ID: 282834-6; Pin Count: 6; Package: None; Price: None; MP: 282834-6; Component Type: Standard; Source: 282834-6.SchLib; Value: *
R13 R14 R21 R22 R30 R31 R38 R39 = RES_1206: Resistor SMD 1206; Manufacturer: *; Manufacturer Part Number: *; Distributor Link: *; LCSC: *
R15-R20 R23-R28 R32-R37 R40-R45 = RES_0402: Resistor SMD 0402; Manufacturer: *; Manufacturer Part Number: *; Distributor Link: *; LCSC: *
R29 R46 = RES_1206: Resistor SMD 1206 nonMELF; Manufacturer: *; Manufacturer Part Number: *; Distributor Link: *; LCSC: *
U3 U6 = PTPS274160ARLHR: No Description Available; Mfr_Name: Texas Instruments; Type: DEV; RefDes: RefDes; Copyright: Copyright (C) 2023 Ultra Librarian. All rights reserved.; Manufacturer_Part_Number: PTPS274160ARLHR
U4 U5 U7 U8 = CMP-04872-000004-1: ISOLATED 24-V TO 60-V DIGITAL IN; Manufacturer: Texas Instruments; Standoff Height: 0.11mm; Max Supply Voltage: 5.5V; Min Supply Voltage: 2.25V; Nominal Supply Current: 194-389mA; Max Junction Temp: +150°C; ComponentLink2URL: http://www.ti.com/lit/ds/symlink/iso1212.pdf; Device Class L1: Integrated Circuits (ICs); Octopart: https://octopart.com/iso1212dbqr-texas+instruments-84619664; Ipc Land Pattern Name: SOP64P600X175-16; Ambient Temperature Range High: +125°C; Automotive: No; Temperature Range High: +125°C; Manufacturer Part Number: ISO1212DBQR; Package: DBQ0016A; Lead Free: Yes; RoHS: TRUE; Device Class L3: unset; Digikey Description: ISOLATED 24-V TO 60-V DIGITAL IN; ComponentLink2Description: Datasheet; Height: 1.75mm; Device Class L2: Interface ICs; Temperature Range Low: -55°C; Ambient Temperature Range Low: -40°C; Category: IC; Temperature: -55°C to +125°C

## Sheet Comm.SchDoc
size A3; SheetNumber: 5; SheetTotal: 6
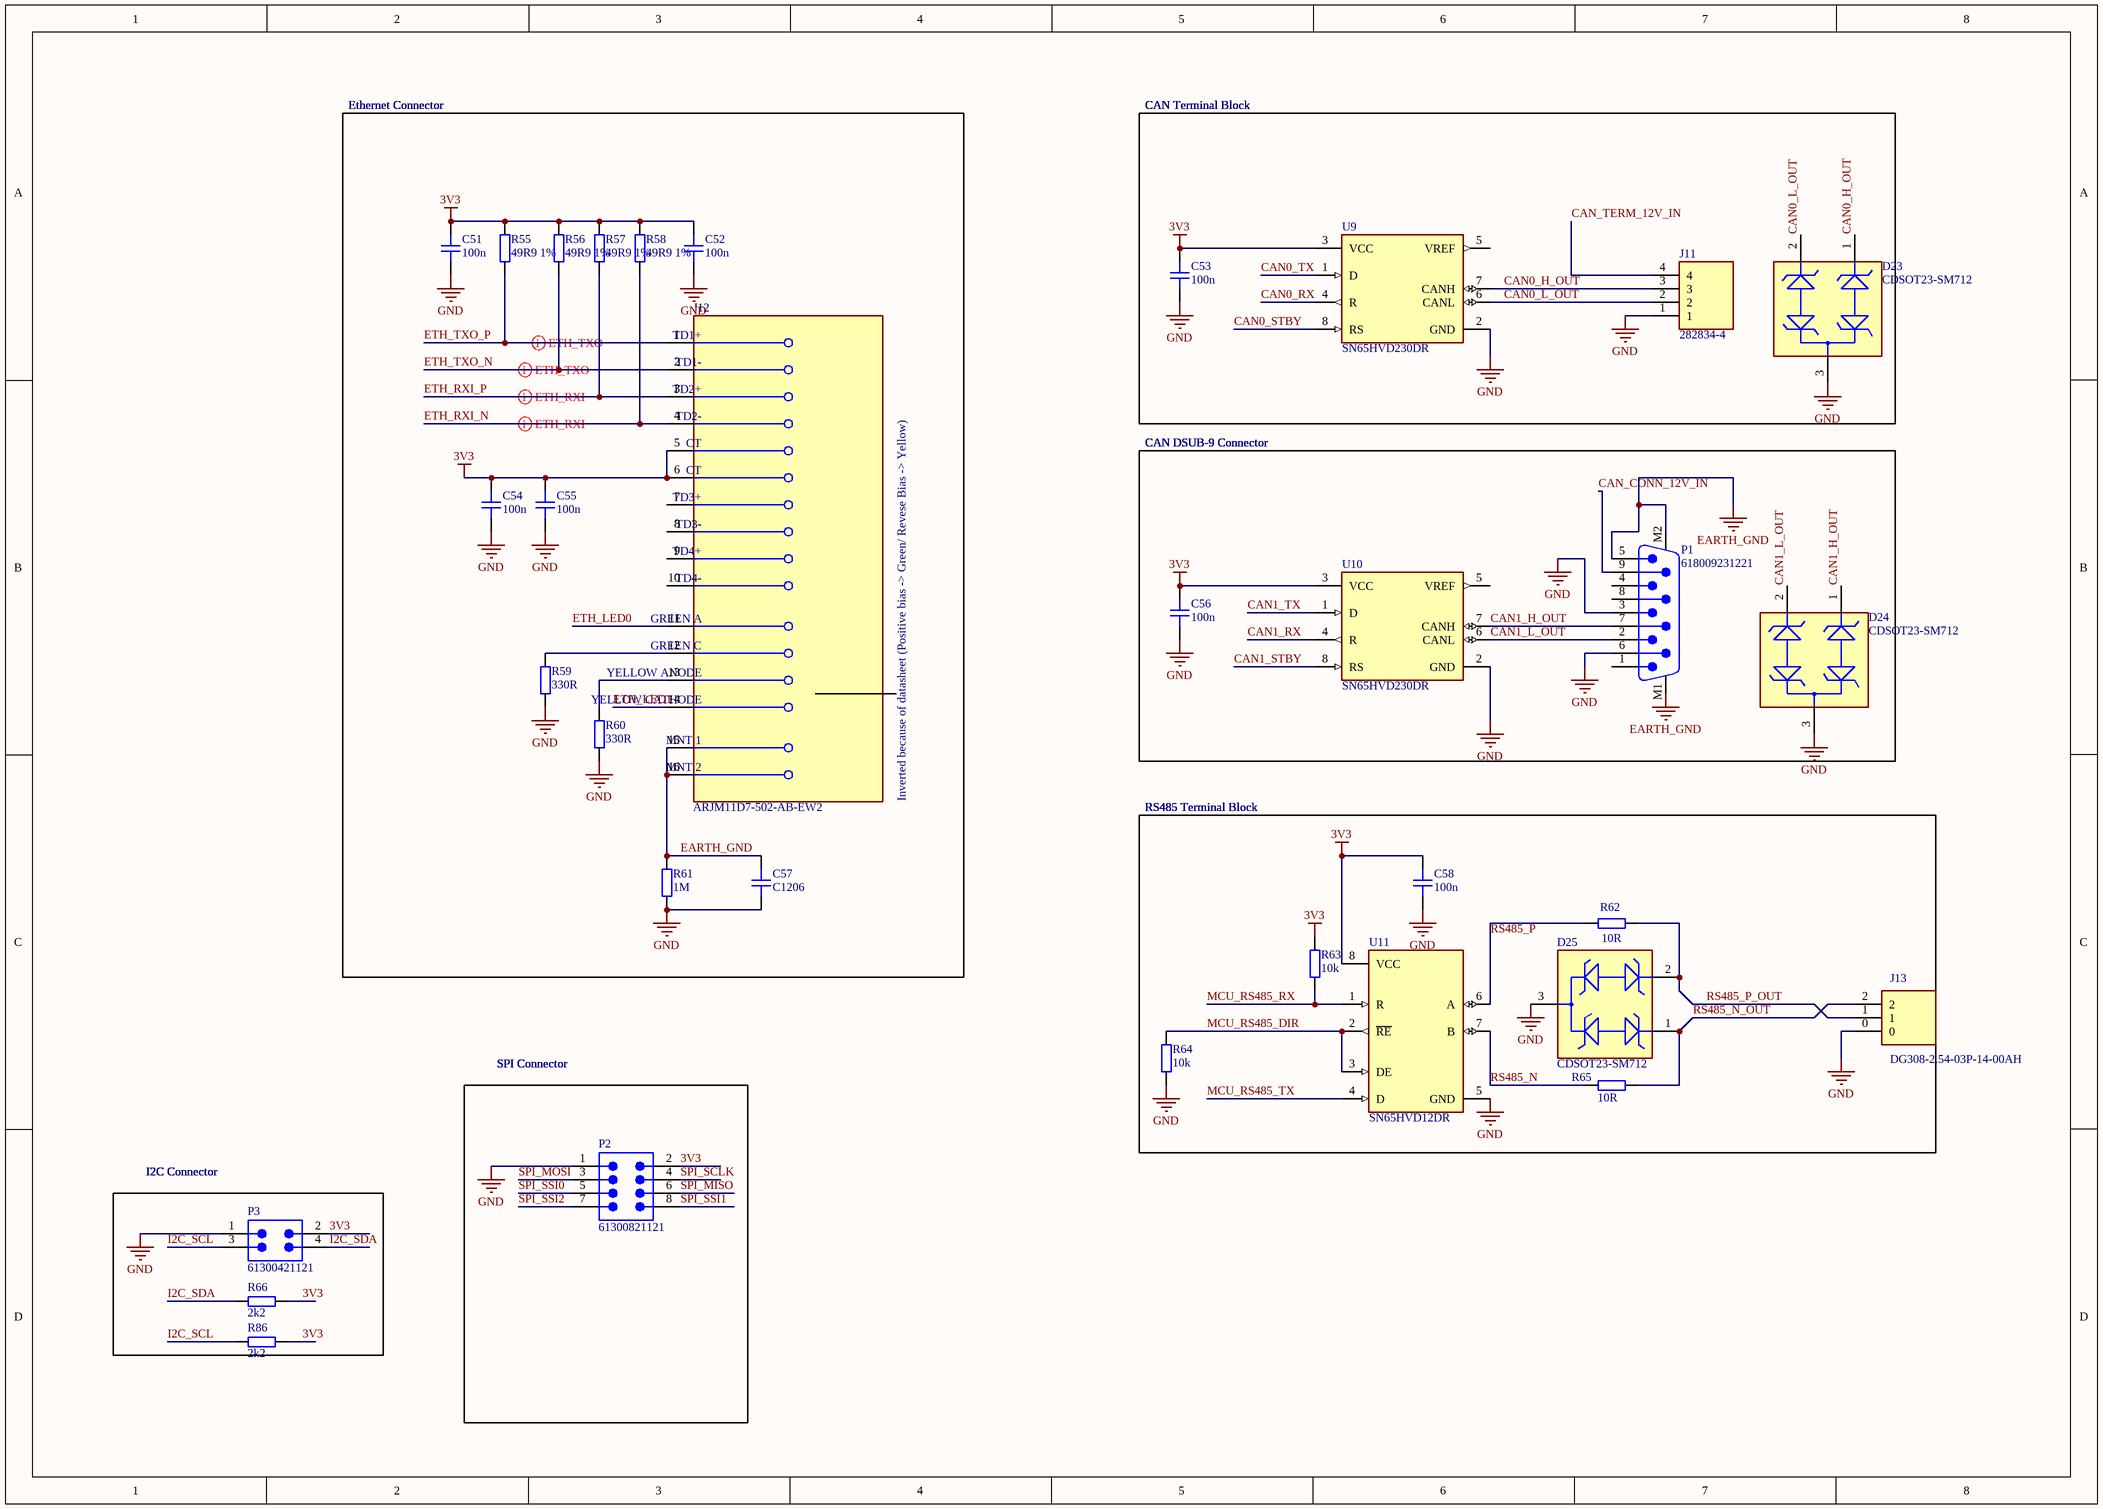
[diagram p3: Comm.SchDoc]

### Parts
C51  100n  [CAP_0402]
C52  100n  [CAP_0402]
C53  100n  [CAP_0402]
C54  100n  [CAP_0402]
C55  100n  [CAP_0402]
C56  100n  [CAP_0402]
C57  C1206  [CAP_1206]
C58  100n  [CAP_0402]
D23  CDSOT23-SM712  [FP-SOT23-MFG]
D24  CDSOT23-SM712  [FP-SOT23-MFG]
D25  CDSOT23-SM712  [FP-SOT23-MFG]
J11  282834-4  [TE_282834-4]
J12  ARJM11D7-502-AB-EW2  [FP-ARJM11D7-502-AB-EW2-MFG]
J13  DG308-2.54-03P-14-00AH  [DG308-2.54-03P-14-00AH-Footprint-1]
P1  618009231221  [618009231221]
P2  61300821121  [61300821121]
P3  61300421121  [61300421121]
R55  49R9 1%  [RES_0402]
R56  49R9 1%  [RES_0402]
R57  49R9 1%  [RES_0402]
R58  49R9 1%  [RES_0402]
R59  330R  [RES_0402]
R60  330R  [RES_0402]
R61  1M  [RES_0402]
R62  10R  [RES_0603]
R63  10k  [RES_0402]
R64  10k  [RES_0402]
R65  10R  [RES_0603]
R66  2k2  [RES_0402]
R86  2k2  [RES_0402]
U9  SN65HVD230DR  [FP-D0008A-IPC_A]
U10  SN65HVD230DR  [FP-D0008A-IPC_A]
U11  SN65HVD12DR  [FP-D0008A-MFG]

### Nets
3V3: C51.2 C52.2 C53.2 C54.2 C55.2 C56.2 C58.2 J12.5(CT) J12.6(CT) P2.2 P3.2 R55.2 R56.2 R57.2 R58.2 R63.2 R66.1 R86.1 U9.3(VCC) U10.3(VCC) U11.8(VCC)
EARTH_GND: C57.2 J12.15(MNT_1) J12.16(MNT_2) P1.5 P1.M1 P1.M2 R61.2
GND: C51.1 C52.1 C53.1 C54.1 C55.1 C56.1 C57.1 C58.1 D23.3 D24.3 D25.3 J11.1 J13.0 P1.3 P1.6 P2.1 P3.1 R59.1 R60.1 R61.1 R64.1 U9.2(GND) U10.2(GND) U11.5(GND)
CAN0_H_OUT: D23.1 J11.3 U9.7(CANH)
CAN0_L_OUT: D23.2 J11.2 U9.6(CANL)
CAN0_RX: U9.4(R)
CAN0_STBY: U9.8(RS)
CAN0_TX: U9.1(D)
CAN1_H_OUT: D24.1 P1.7 U10.7(CANH)
CAN1_L_OUT: D24.2 P1.2 U10.6(CANL)
CAN1_RX: U10.4(R)
CAN1_STBY: U10.8(RS)
CAN1_TX: U10.1(D)
CAN_CONN_12V_IN: P1.9
CAN_TERM_12V_IN: J11.4
ETH_LED0: J12.11(GREEN_A)
ETH_LED1: J12.14(YELLOW_CATHODE)
ETH_RXI_N: J12.4(TD2-) R58.1
ETH_RXI_P: J12.3(TD2+) R57.1
ETH_TXO_N: J12.2(TD1-) R56.1
ETH_TXO_P: J12.1(TD1+) R55.1
I2C_SCL: P3.3 R86.2
I2C_SDA: P3.4 R66.2
MCU_RS485_DIR: R64.2 U11.2(~{RE}) U11.3(DE)
MCU_RS485_RX: R63.1 U11.1(R)
MCU_RS485_TX: U11.4(D)
RS485_N: R65.1 U11.7(B)
RS485_N_OUT: D25.1 J13.2 R65.2
RS485_P: R62.1 U11.6(A)
RS485_P_OUT: D25.2 J13.1 R62.2
SPI_MISO: P2.6
SPI_MOSI: P2.3
SPI_SCLK: P2.4
SPI_SSI0: P2.5
SPI_SSI1: P2.8
SPI_SSI2: P2.7
NetJ12_12: J12.12(GREEN_C) R59.2
NetJ12_13: J12.13(YELLOW_ANODE) R60.2

Not connected (* = marked no-connect by the designer): J12 7(TD3+) 8(TD3-) 9(TD4+) 10(TD4-); P1 1 4 8; U9 5(VREF); U10 5(VREF)

### Layout directives
differential pair; differential pair class ETH: ETH_RXI_N, ETH_RXI_P, ETH_TXO_N, ETH_TXO_P

### Notes on the sheet
- Ethernet Connector
- CAN Terminal Block
- CAN DSUB-9 Connector
- Inverted because of datasheet (Positive bias -> Green/ Revese Bias -> Yellow)
- RS485 Terminal Block
- SPI Connector
- I2C Connector

### Library data of the parts
C51-C56 C58 = CAP_0402: Capacitor SMD 0402; Manufacturer: *; Manufacturer Part Number: *; Distributor Link: *; LCSC: *; Rating: *; Dielectric: *
C57 = CAP_1206: 4700pF 2kV; Manufacturer: *; Manufacturer Part Number: *; Distributor Link: *; LCSC: *; Rating: *; Dielectric: *
D23-D25 = CMP-2000-05081-2: TVS DIODE 7V/12V 14V/26V SOT23-3; Manufacturer: Bourns Inc.; Peak Pulse Current: 17A; Standoff Height: 0.05mm; Breakdown Voltage: 7.5V; Direction: Bidirectional; Clamping Voltage: 26V; Value: 75pF; Number Of Channels: 2; Reverse Standoff Voltage: 12V; Peak Pulse Power: 400W; Temperature Range Low: -55°C; Mouser Description: Transient Voltage Suppressor, TVS, CDSOT23 Series, Unidirectional, 12 V, SOT-23, 3, 13.3 V; Device Class L3: unset; Package: SOT23; Height: 1.17mm; RoHS: TRUE; Octopart: https://octopart.com/cdsot23-sm712-bourns-7576327; Category: Diode; Ipc Land Pattern Name: SOT95P229X103-3; ComponentLink2URL: https://www.bourns.com/docs/Product-Datasheets/CDSOT23-SM712.pdf; Temperature Range High: +150°C; ComponentLink2Description: Datasheet; Digikey Description: TVS DIODE 7V/12V 14V/26V SOT23-3; Manufacturer Part Number: CDSOT23-SM712; Temperature: -55°C to +150°C; Device Class L2: TVS Diodes; Lead Free: Yes; Device Class L1: Circuit Protection; Automotive: No; Capacitance: 75pF
J11 = 282834-4: as J6 on sheet Power; Check_prices: https://www.snapeda.com/parts/282834-4/TE+Connectivity+AMP+Connectors/view-part/?ref=eda; Price: None; MP: 282834-4; Package: None; Value: *; Purchase-URL: https://pricing.snapeda.com/search/part/282834-4/?ref=eda; Availability: In Stock; EU_RoHS_Compliance: Compliant with Exemptions; SnapEDA_Link: https://www.snapeda.com/parts/282834-4/TE+Connectivity+AMP+Connectors/view-part/?ref=snap
J12 = CMP-27893-000003-1: CONN JACK 1PORT 1000 BASE-T PCB; Number of Ports: 1; Connector Type: RJ45; Shielding: Shielded; Direction: Up; Number of Cores per Jack: 8; Max Operating Temperature: 85°C; Min Operating Temperature: -40°C; Contact Plating: Gold; RoHS Compliant: Yes; Termination: Solder; Mount: Through Hole; Color: Green; Number of Rows: 1; Packaging: Tray
J13 = CMP-002-00073-4: 2.54mm PCB Terminal Block Angled 90 Degree
P1 = CMP-1502-00284-2: NexarPartId: 22865742; Pitch: 2.77mm; Number of Contacts: 9; Operating Supply Voltage: 125V; Insulation Resistance: 5GΩ; Gender: Male; Contact Resistance: 30mΩ; Current Rating: 3A; Mount: Through Hole; Housing Material: Steel; Contact Plating: Gold; Width: 12.5mm; Insulation Material: PBT; RoHS: Compliant; Depth: 18.5mm; Contact Material: Gold; Max Operating Temperature: 105°C; Min Operating Temperature: -55°C; Termination: SMD/SMT; Height: 12.7mm; Voltage Rating: 125V; Length: 30.8mm; Orientation: Right Angle; Number of Rows: 2; Number of Pins: 9; REACH SVHC: Unknown
P2 = CMP-1502-01078-2: NexarPartId: 32855534; Operating Supply Voltage: 250V; Row Spacing: 2.54mm; Contact Resistance: 20mΩ; Number of Contacts: 8; Current Rating: 3A; Connector Type: Male Pin; Gender: Male; Min Operating Temperature: -40°C; Number of Pins: 8; Mount: Through Hole; Height: 8.89mm; Lead Pitch: 2.54mm; Contact Mating Length: 5.9944mm; Packaging: Bulk; Pitch: 2.54mm; RoHS: Compliant; Number of Rows: 2; REACH SVHC: Unknown; Termination: Solder; Orientation: Vertical; Contact Plating: Gold; Max Operating Temperature: 105°C; Number of Positions: 8; Lead Free: Lead Free; Contact Material: Copper; Color: Black; Voltage Rating: 250V
P3 = CMP-1502-01066-3: NexarPartId: 32855524; Number of Positions: 4; Connector Type: Male Pin; Row Spacing: 2.54mm; Current Rating: 3A; Gender: Male; Voltage Rating: 250V; Contact Resistance: 20mΩ; Contact Mating Length: 5.9944mm; Height: 8.89mm; Contact Plating: Gold; Color: Black; Lead Pitch: 2.54mm; Contact Material: Copper; Number of Rows: 2; Min Operating Temperature: -40°C; Mount: Through Hole; RoHS: Compliant; Number of Pins: 4; Lead Free: Lead Free; Packaging: Bulk; Max Operating Temperature: 105°C; Orientation: Vertical; Pitch: 2.54mm; Number of Contacts: 4; Operating Supply Voltage: 250V; REACH SVHC: Unknown; Termination: Solder
R55-R61 R63 R64 R66 R86 = RES_0402: Resistor SMD 0402; Manufacturer: *; Manufacturer Part Number: *; Distributor Link: *; LCSC: *
R62 R65 = RES_0603: Resistor SMD 0603; Manufacturer: *; Manufacturer Part Number: *; Distributor Link: *; LCSC: *
U9 U10 = CMP-0315-00015-3: IC TRANSCEIVER HALF 1/1 8SOIC; Number of Transceivers: 1; Operating Supply Voltage: 3.3V; Number of I/Os: 2; Max Supply Current: 17mA; Max Supply Voltage: 3.6V; Min Supply Voltage: 3V; Data Rate: 1Mbps; Min Operating Temperature: -40°C; Packaging: Tape and Reel; Lead Free: Lead Free; Number of Transmit Buffers: 1; Max Operating Temperature: 85°C; Number of Receive Buffers: 1; Number of Pins: 8; Package Quantity: 1; Radiation Hardening: No; Case/Package: D; REACH SVHC: No SVHC; Weight: 0.002561oz; Termination: SMD/SMT; Contact Plating: Gold; Nominal Supply Current: 17mA; Number of Receivers: 1; Number of Drivers: 1
U11 = CMP-04875-000007-1: IC TRANSCEIVER HALF 1/1 8SOIC; Manufacturer: Texas Instruments; Standoff Height: 0.11mm; Max Supply Voltage: 3.6V; Simplex Duplex: Half Duplex; Min Supply Voltage: 3V; Number Of Receivers: 1; Interface: RS-485,RS-422; Max Junction Temp: +145°C; Nominal Supply Current: 9mA; Data Rate: 1Mbits/s; Manufacturer Part Number: SN65HVD12DR; Digikey Description: IC TRANSCEIVER HALF 1/1 8SOIC; Category: IC; Octopart: https://octopart.com/sn65hvd12dr-texas+instruments-713591; RoHS: TRUE; Temperature Range Low: -40°C; Device Class L2: Interface ICs; Device Class L3: RS-232 / RS-422 / RS-485 Interface ICs; Lead Free: Yes; Mouser Description: RS-485 Interface IC 3.3V Differential Transceivers; Ambient Temperature Range Low: -40°C; Number Of Transmitters: 1; Ipc Land Pattern Name: SOIC127P600X175-8; Temperature Range High: +85°C; ComponentLink2URL: http://www.ti.com/lit/ds/symlink/sn65hvd12.pdf; Package: D0008A; ComponentLink2Description: Datasheet; Height: 1.75mm; Automotive: No; Device Class L1: Integrated Circuits (ICs); Temperature: -40°C to +85°C; Ambient Temperature Range High: +85°C

## Sheet Debug.SchDoc
size A3; SheetNumber: 6; SheetTotal: 6
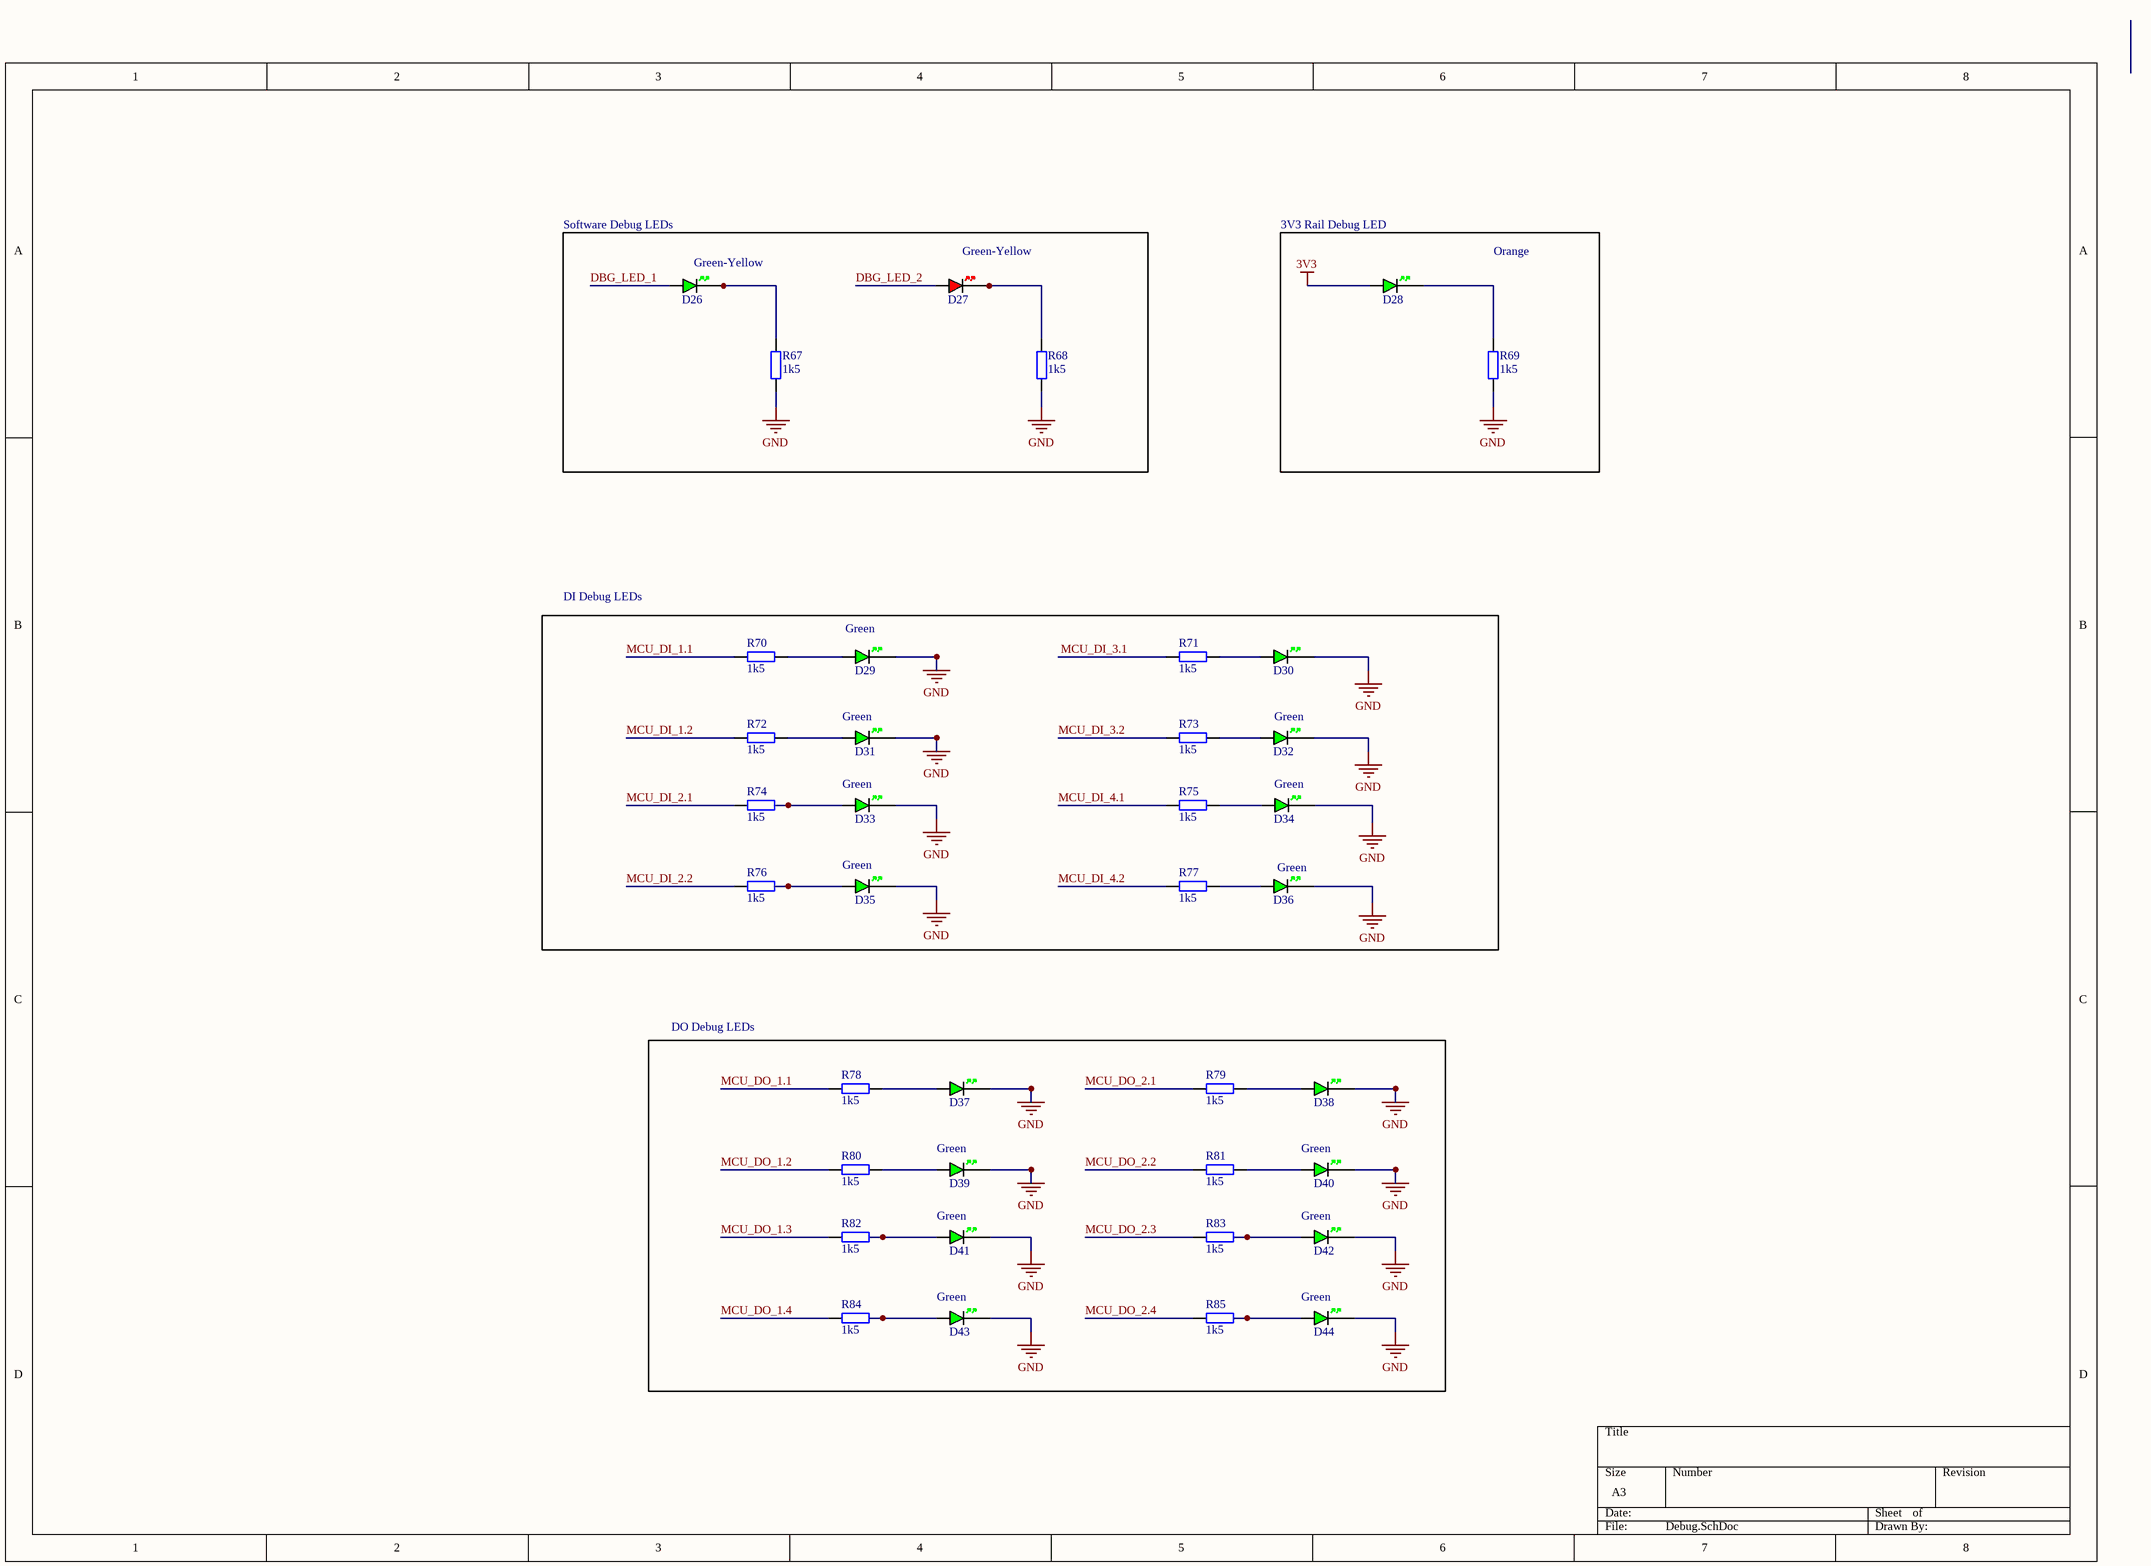
[diagram p4: Debug.SchDoc]

### Parts
D26  GREEN  [LED_0402_GREEN]  (value not drawn)
D27  RED  [LED_0402_RED]  (value not drawn)
D28  GREEN  [LED_0402_GREEN]  (value not drawn)
D29  GREEN  [LED_0402_GREEN]  (value not drawn)
D30  GREEN  [LED_0402_GREEN]  (value not drawn)
D31  GREEN  [LED_0402_GREEN]  (value not drawn)
D32  GREEN  [LED_0402_GREEN]  (value not drawn)
D33  GREEN  [LED_0402_GREEN]  (value not drawn)
D34  GREEN  [LED_0402_GREEN]  (value not drawn)
D35  GREEN  [LED_0402_GREEN]  (value not drawn)
D36  GREEN  [LED_0402_GREEN]  (value not drawn)
D37  GREEN  [LED_0402_GREEN]  (value not drawn)
D38  GREEN  [LED_0402_GREEN]  (value not drawn)
D39  GREEN  [LED_0402_GREEN]  (value not drawn)
D40  GREEN  [LED_0402_GREEN]  (value not drawn)
D41  GREEN  [LED_0402_GREEN]  (value not drawn)
D42  GREEN  [LED_0402_GREEN]  (value not drawn)
D43  GREEN  [LED_0402_GREEN]  (value not drawn)
D44  GREEN  [LED_0402_GREEN]  (value not drawn)
R67  1k5  [RES_0402]
R68  1k5  [RES_0402]
R69  1k5  [RES_0402]
R70  1k5  [RES_0402]
R71  1k5  [RES_0402]
R72  1k5  [RES_0402]
R73  1k5  [RES_0402]
R74  1k5  [RES_0402]
R75  1k5  [RES_0402]
R76  1k5  [RES_0402]
R77  1k5  [RES_0402]
R78  1k5  [RES_0402]
R79  1k5  [RES_0402]
R80  1k5  [RES_0402]
R81  1k5  [RES_0402]
R82  1k5  [RES_0402]
R83  1k5  [RES_0402]
R84  1k5  [RES_0402]
R85  1k5  [RES_0402]

### Nets
3V3: D28.A
GND: D29.K D30.K D31.K D32.K D33.K D34.K D35.K D36.K D37.K D38.K D39.K D40.K D41.K D42.K D43.K D44.K R67.1 R68.1 R69.1
DBG_LED_1: D26.A
DBG_LED_2: D27.A
MCU_DI_1.1: R70.2
MCU_DI_1.2: R72.2
MCU_DI_2.1: R74.2
MCU_DI_2.2: R76.2
MCU_DI_3.1: R71.2
MCU_DI_3.2: R73.2
MCU_DI_4.1: R75.2
MCU_DI_4.2: R77.2
MCU_DO_1.1: R78.2
MCU_DO_1.2: R80.2
MCU_DO_1.3: R82.2
MCU_DO_1.4: R84.2
MCU_DO_2.1: R79.2
MCU_DO_2.2: R81.2
MCU_DO_2.3: R83.2
MCU_DO_2.4: R85.2
NetD26_K: D26.K R67.2
NetD27_K: D27.K R68.2
NetD28_K: D28.K R69.2
NetD29_A: D29.A R70.1()
NetD30_A: D30.A R71.1()
NetD31_A: D31.A R72.1()
NetD32_A: D32.A R73.1()
NetD33_A: D33.A R74.1()
NetD34_A: D34.A R75.1()
NetD35_A: D35.A R76.1()
NetD36_A: D36.A R77.1()
NetD37_A: D37.A R78.1()
NetD38_A: D38.A R79.1()
NetD39_A: D39.A R80.1()
NetD40_A: D40.A R81.1()
NetD41_A: D41.A R82.1()
NetD42_A: D42.A R83.1()
NetD43_A: D43.A R84.1()
NetD44_A: D44.A R85.1()

### Notes on the sheet
- (near D26) Software Debug LEDs
- (near D28) 3V3 Rail Debug LED
- (near D26) Green-Yellow
- (near D27) Green-Yellow
- Orange
- DI Debug LEDs
- (near D29) Green
- (near D31) Green
- (near D32) Green
- (near D33) Green
- (near D34) Green
- (near D35) Green
- (near D36) Green
- DO Debug LEDs
- (near D39) Green
- (near D40) Green
- (near D41) Green
- (near D42) Green
- (near D43) Green
- (near D44) Green

### Library data of the parts
D26 D28-D44 = LED_0402_GREEN: LED 0402 GREEN SMD
D27 = LED_0402_RED: LED 0402 RED SMD
R67-R85 = RES_0402: Resistor SMD 0402; Manufacturer: *; Manufacturer Part Number: *; Distributor Link: *; LCSC: *

## Nets that join several sheets
3V3: Main (J1.1 R1.1), Power (29 pins), DigitalIO (14 pins), Comm (21 pins), Debug (D28.A)
EARTH_GND: Main (J2.1 J2.2 J2.3 J2.4), Comm (7 pins)
FGND: Power (C17.2 J4.0), DigitalIO (20 pins)
GND: Main (19 pins), Power (29 pins), DigitalIO (26 pins), Comm (24 pins), Debug (19 pins)
OGND_1: Power (C20.1 D8.A J6.1), DigitalIO (10 pins)
OGND_2: Power (C18.1 D7.A J6.3), DigitalIO (10 pins)
CAN0_RX: Main (U1.33), Comm (U9.4)
CAN0_STBY: Main (U1.116), Comm (U9.8)
CAN0_TX: Main (U1.34), Comm (U9.1)
CAN1_RX: Main (U1.95), Comm (U10.4)
CAN1_STBY: Main (U1.117), Comm (U10.8)
CAN1_TX: Main (U1.96), Comm (U10.1)
CAN_CONN_12V_IN: Power (D5.A TP4.1), Comm (P1.9)
CAN_TERM_12V_IN: Power (D4.A TP3.1), Comm (J11.4)
DBG_LED_1: Main (U1.85), Debug (D26.A)
DBG_LED_2: Main (U1.91), Debug (D27.A)
ETH_LED0: Main (U1.61), Comm (J12.11)
ETH_LED1: Main (U1.63), Comm (J12.14)
ETH_RXI_N: Main (U1.53), Comm (J12.4 R58.1)
ETH_RXI_P: Main (U1.54), Comm (J12.3 R57.1)
ETH_TXO_N: Main (U1.56), Comm (J12.2 R56.1)
ETH_TXO_P: Main (U1.57), Comm (J12.1 R55.1)
I2C_SCL: Main (U1.1), Comm (P3.3 R86.2)
I2C_SDA: Main (U1.2), Comm (P3.4 R66.2)
MCU_AI_CS_1: Main (U1.123), DigitalIO (C35.2 R25.1)
MCU_AI_CS_2: Main (U1.124), DigitalIO (C46.2 R42.1)
MCU_DI_1.1: Main (U1.110), DigitalIO (U4.4), Debug (R70.2)
MCU_DI_1.2: Main (U1.109), DigitalIO (U4.5), Debug (R72.2)
MCU_DI_2.1: Main (U1.112), DigitalIO (U5.4), Debug (R74.2)
MCU_DI_2.2: Main (U1.111), DigitalIO (U5.5), Debug (R76.2)
MCU_DI_3.1: Main (U1.119), DigitalIO (U7.4), Debug (R71.2)
MCU_DI_3.2: Main (U1.118), DigitalIO (U7.5), Debug (R73.2)
MCU_DI_4.1: Main (U1.121), DigitalIO (U8.4), Debug (R75.2)
MCU_DI_4.2: Main (U1.120), DigitalIO (U8.5), Debug (R77.2)
MCU_DO_1.1: Main (U1.81), DigitalIO (R15.2), Debug (R78.2)
MCU_DO_1.2: Main (U1.78), DigitalIO (R18.2), Debug (R80.2)
MCU_DO_1.3: Main (U1.77), DigitalIO (R19.2), Debug (R82.2)
MCU_DO_1.4: Main (U1.76), DigitalIO (R20.2), Debug (R84.2)
MCU_DO_2.1: Main (U1.42), DigitalIO (R32.2), Debug (R79.2)
MCU_DO_2.2: Main (U1.43), DigitalIO (R35.2), Debug (R81.2)
MCU_DO_2.3: Main (U1.44), DigitalIO (R36.2), Debug (R83.2)
MCU_DO_2.4: Main (U1.45), DigitalIO (R37.2), Debug (R85.2)
MCU_DO_DIAG_EN_1: Main (U1.71), DigitalIO (U3.11)
MCU_DO_DIAG_EN_2: Main (U1.103), DigitalIO (U6.11)
MCU_DO_FAULT_N_1: Main (U1.73), DigitalIO (R26.1 U3.5)
MCU_DO_FAULT_N_2: Main (U1.105), DigitalIO (R43.1 U6.5)
MCU_DO_SEH_1: Main (U1.75), DigitalIO (U3.3)
MCU_DO_SEH_2: Main (U1.107), DigitalIO (U6.3)
MCU_DO_SEL_1: Main (U1.74), DigitalIO (U3.4)
MCU_DO_SEL_2: Main (U1.106), DigitalIO (U6.4)
MCU_RS485_DIR: Main (U1.127), Comm (R64.2 U11.2 U11.3)
MCU_RS485_RX: Main (U1.125), Comm (R63.1 U11.1)
MCU_RS485_TX: Main (U1.126), Comm (U11.4)
Power_IN_DO_1: Power (5 pins), DigitalIO (U3.17 U3.18 U3.19 U3.20)
Power_IN_DO_2: Power (5 pins), DigitalIO (U6.17 U6.18 U6.19 U6.20)
SPI_MISO: Main (U1.38), Comm (P2.6)
SPI_MOSI: Main (U1.37), Comm (P2.3)
SPI_SCLK: Main (U1.35), Comm (P2.4)
SPI_SSI0: Main (U1.40), Comm (P2.5)
SPI_SSI1: Main (U1.41), Comm (P2.8)
SPI_SSI2: Main (U1.46), Comm (P2.7)
USB_VIN: Main (J2.A4-B9 J2.A9-B4 R4.2), Power (D3.A TP2.1)